# EAGLE schematic oresat-c3 (EAGLE 9.6.2), part 1 of 2
Assembly variants: LESS_STUFF

## Sheet 1 of 8: Connectors
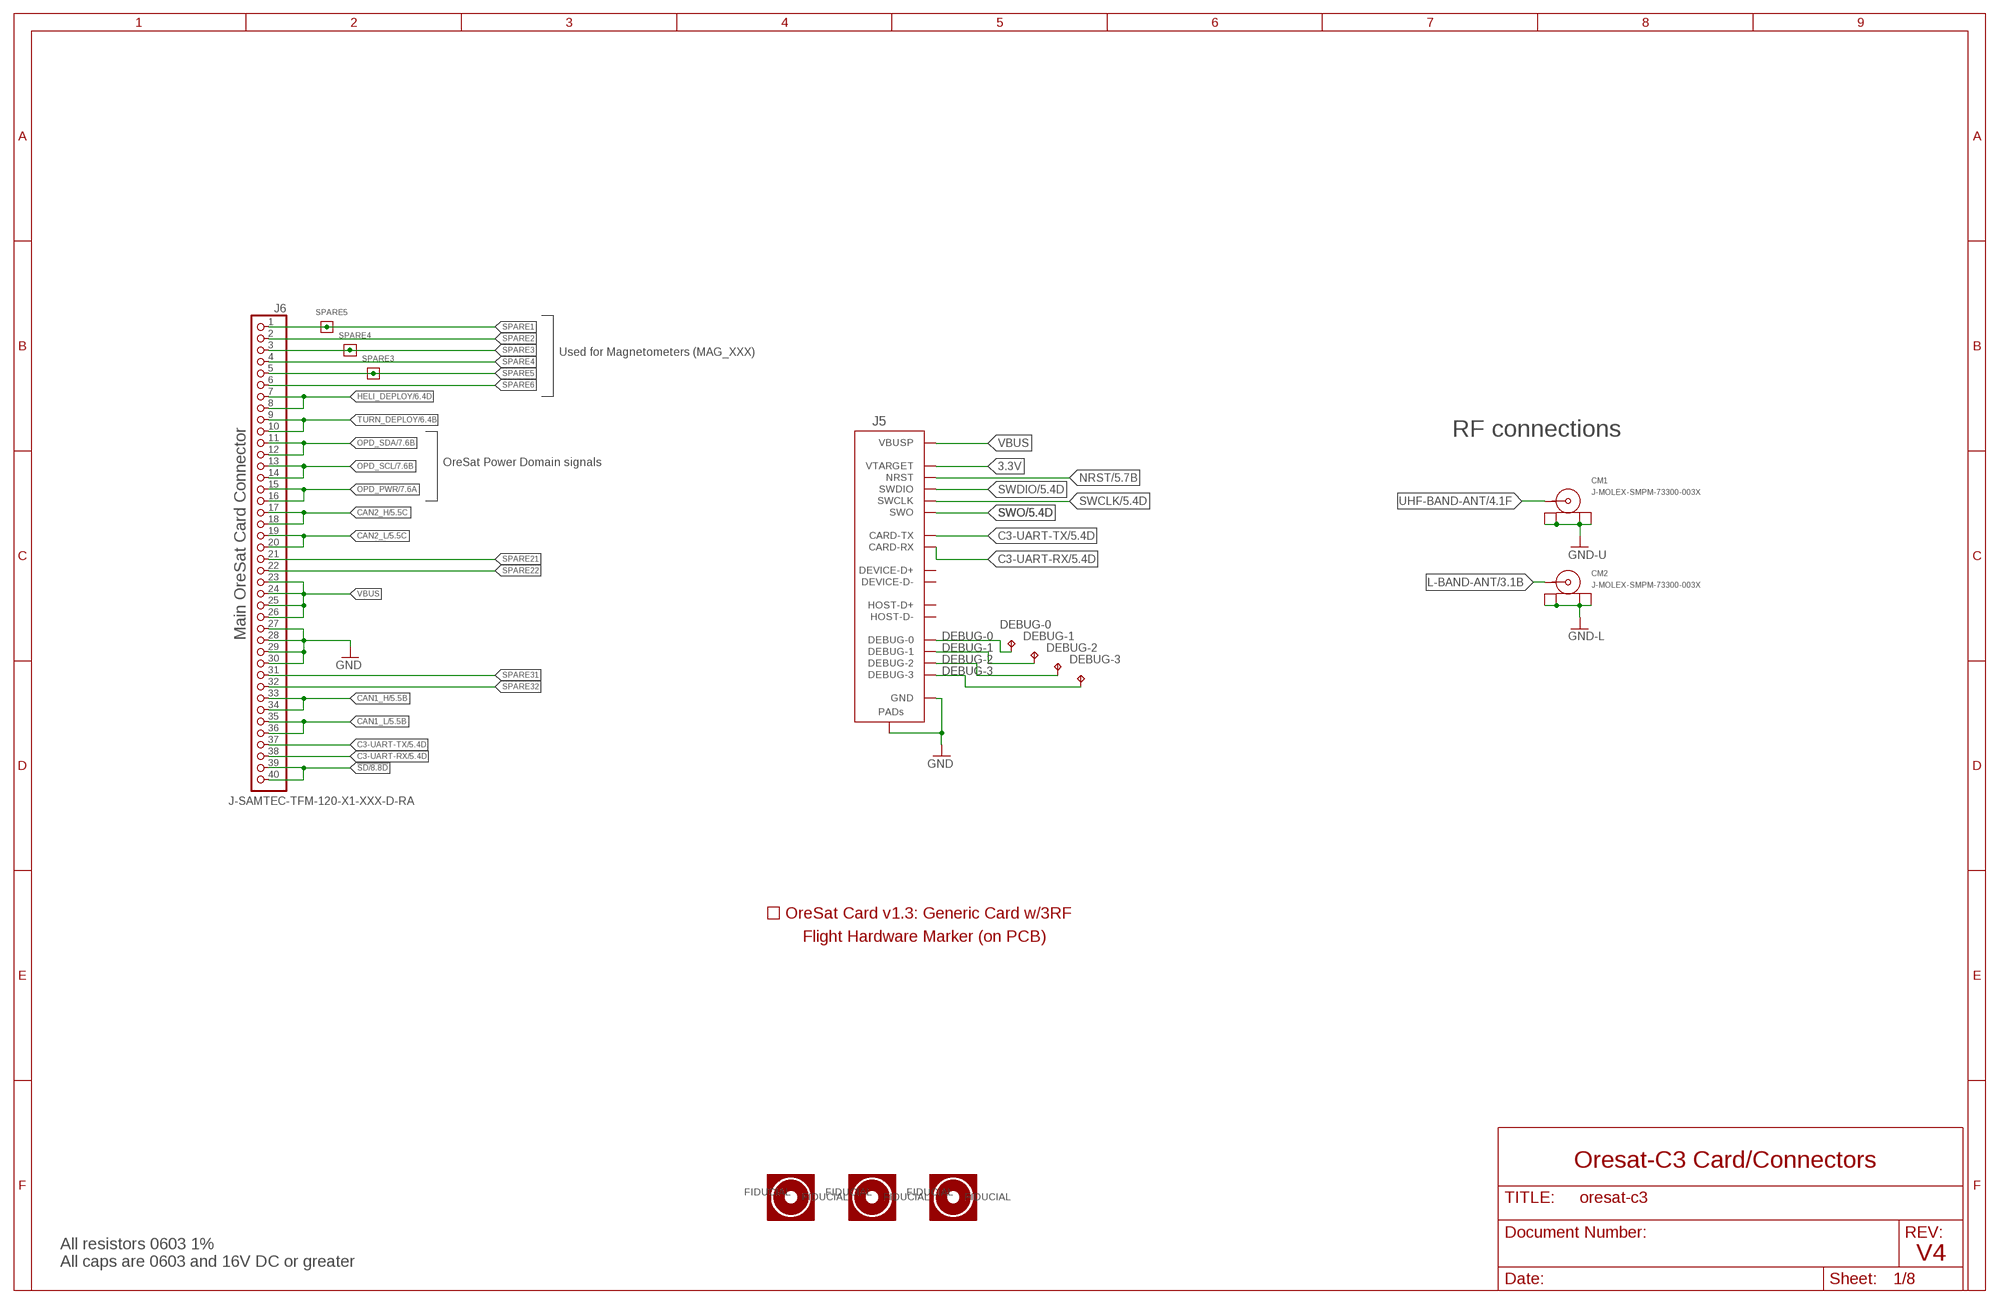
[diagram p0: schematic, sheet 1]

### Parts
CM1  J-MOLEX-SMPM-73300-003X  [J-MOLEX-SMPM-073300-003X]
CM2  J-MOLEX-SMPM-73300-003X  [J-MOLEX-SMPM-073300-003X]
DEBUG-0  TEST-POINT-SMALL  [TEST-POINT-SMALL]
DEBUG-1  TEST-POINT-SMALL  [TEST-POINT-SMALL]
DEBUG-2  TEST-POINT-SMALL  [TEST-POINT-SMALL]
DEBUG-3  TEST-POINT-SMALL  [TEST-POINT-SMALL]
FIDUCIAL1  FIDUCIAL-1.0X2.0  [FIDUCIAL-1.0X2.0]
FIDUCIAL2  FIDUCIAL-1.0X2.0  [FIDUCIAL-1.0X2.0]
FIDUCIAL3  FIDUCIAL-1.0X2.0  [FIDUCIAL-1.0X2.0]
J5  ORESAT-DEBUG-CONNECTOR-ALL  [TE_2-1734592-0]
J6  J-SAMTEC-TFM-120-X1-XXX-D-RA  [J-SAMTEC-TFM-120-X1-XXX-D-RA]
PCB1  ORESAT-CARD-V1.3-GENERIC-3RF  [ORESAT-CARD-V1.3-GENERIC-3RF]
SPARE3  TEST-POINT-LARGE-SQUARE  [1X01]
SPARE4  TEST-POINT-LARGE-SQUARE  [1X01]
SPARE5  TEST-POINT-LARGE-SQUARE  [1X01]
U$1  FLIGHMARKERNEW  [FLIGHTMARKER_NEW_BOARDS]

### Nets
3.3V: J5.11(VTARGET) ; also sheet 2,3,5,7
!SD: J6.39 J6.40 ; also sheet 8
C3-UART-RX: J5.12(CARD-RX) J6.38 ; also sheet 5
C3-UART-TX: J5.13(CARD-TX) J6.37 ; also sheet 5
CAN1_H: J6.33 J6.34 ; also sheet 5
CAN1_L: J6.35 J6.36 ; also sheet 5
CAN2_H: J6.17 J6.18 ; also sheet 5
CAN2_L: J6.19 J6.20 ; also sheet 5
DEBUG-0: DEBUG-0.TP J5.17(DEBUG-0)
DEBUG-1: DEBUG-1.TP J5.18(DEBUG-1)
DEBUG-2: DEBUG-2.TP J5.19(DEBUG-2)
DEBUG-3: DEBUG-3.TP J5.20(DEBUG-3)
GND: J5.3(GND) J5.6(GND) J5.9(GND) J5.PAD1(PAD) J5.PAD2(PAD) J6.27 J6.28 J6.29 J6.30 ; also sheet 2,3,4,5,6,7,8
GND-L: CM2.P$1(SHIELD3) CM2.P$2(SHIELD2) CM2.P$3(SHIELD1) CM2.P$4(SHIELD) ; also sheet 2,3
GND-U: CM1.P$1(SHIELD3) CM1.P$2(SHIELD2) CM1.P$3(SHIELD1) CM1.P$4(SHIELD) ; also sheet 2,4
HELI_DEPLOY: J6.7 J6.8 ; also sheet 6
L-BAND-ANT [RF]: CM2.RF(CENTER) ; also sheet 3
NRST: J5.10(NRST) ; also sheet 5
OPD_PWR: J6.15 J6.16 ; also sheet 7
OPD_SCL: J6.13 J6.14 ; also sheet 7
OPD_SDA: J6.11 J6.12 ; also sheet 7
SPARE1: J6.1 SPARE5.1
SPARE2: J6.2
SPARE3: J6.3 SPARE4.1
SPARE4: J6.4
SPARE5: J6.5 SPARE3.1
SPARE6: J6.6
SPARE21: J6.21
SPARE22: J6.22
SPARE31: J6.31
SPARE32: J6.32
SWCLK: J5.15(SWCLK) ; also sheet 5
SWDIO: J5.14(SWDIO) ; also sheet 5
SWO: J5.16(SWO) ; also sheet 5
TURN_DEPLOY: J6.9 J6.10 ; also sheet 6
UHF-BAND-ANT [RF]: CM1.RF(CENTER) ; also sheet 4
VBUS: J5.1(VBUSP) J5.2(VBUSP) J6.23 J6.24 J6.25 J6.26 ; also sheet 2,6,8
Unconnected: FIDUCIAL1.FIDUCIAL FIDUCIAL2.FIDUCIAL FIDUCIAL3.FIDUCIAL J5.4(DEVICE-D+) J5.5(DEVICE-D-) J5.7(HOST-D+) J5.8(HOST-D-)

### Notes on the sheet
- Used for Magnetometers (MAG_XXX)
- RF connections
- OreSat Power Domain signals
- Main OreSat Card Connector
- Oresat-C3 Card/Connectors
- V4
- All resistors 0603 1%
  All caps are 0603 and 16V DC or greater

## Sheet 2 of 8: Power
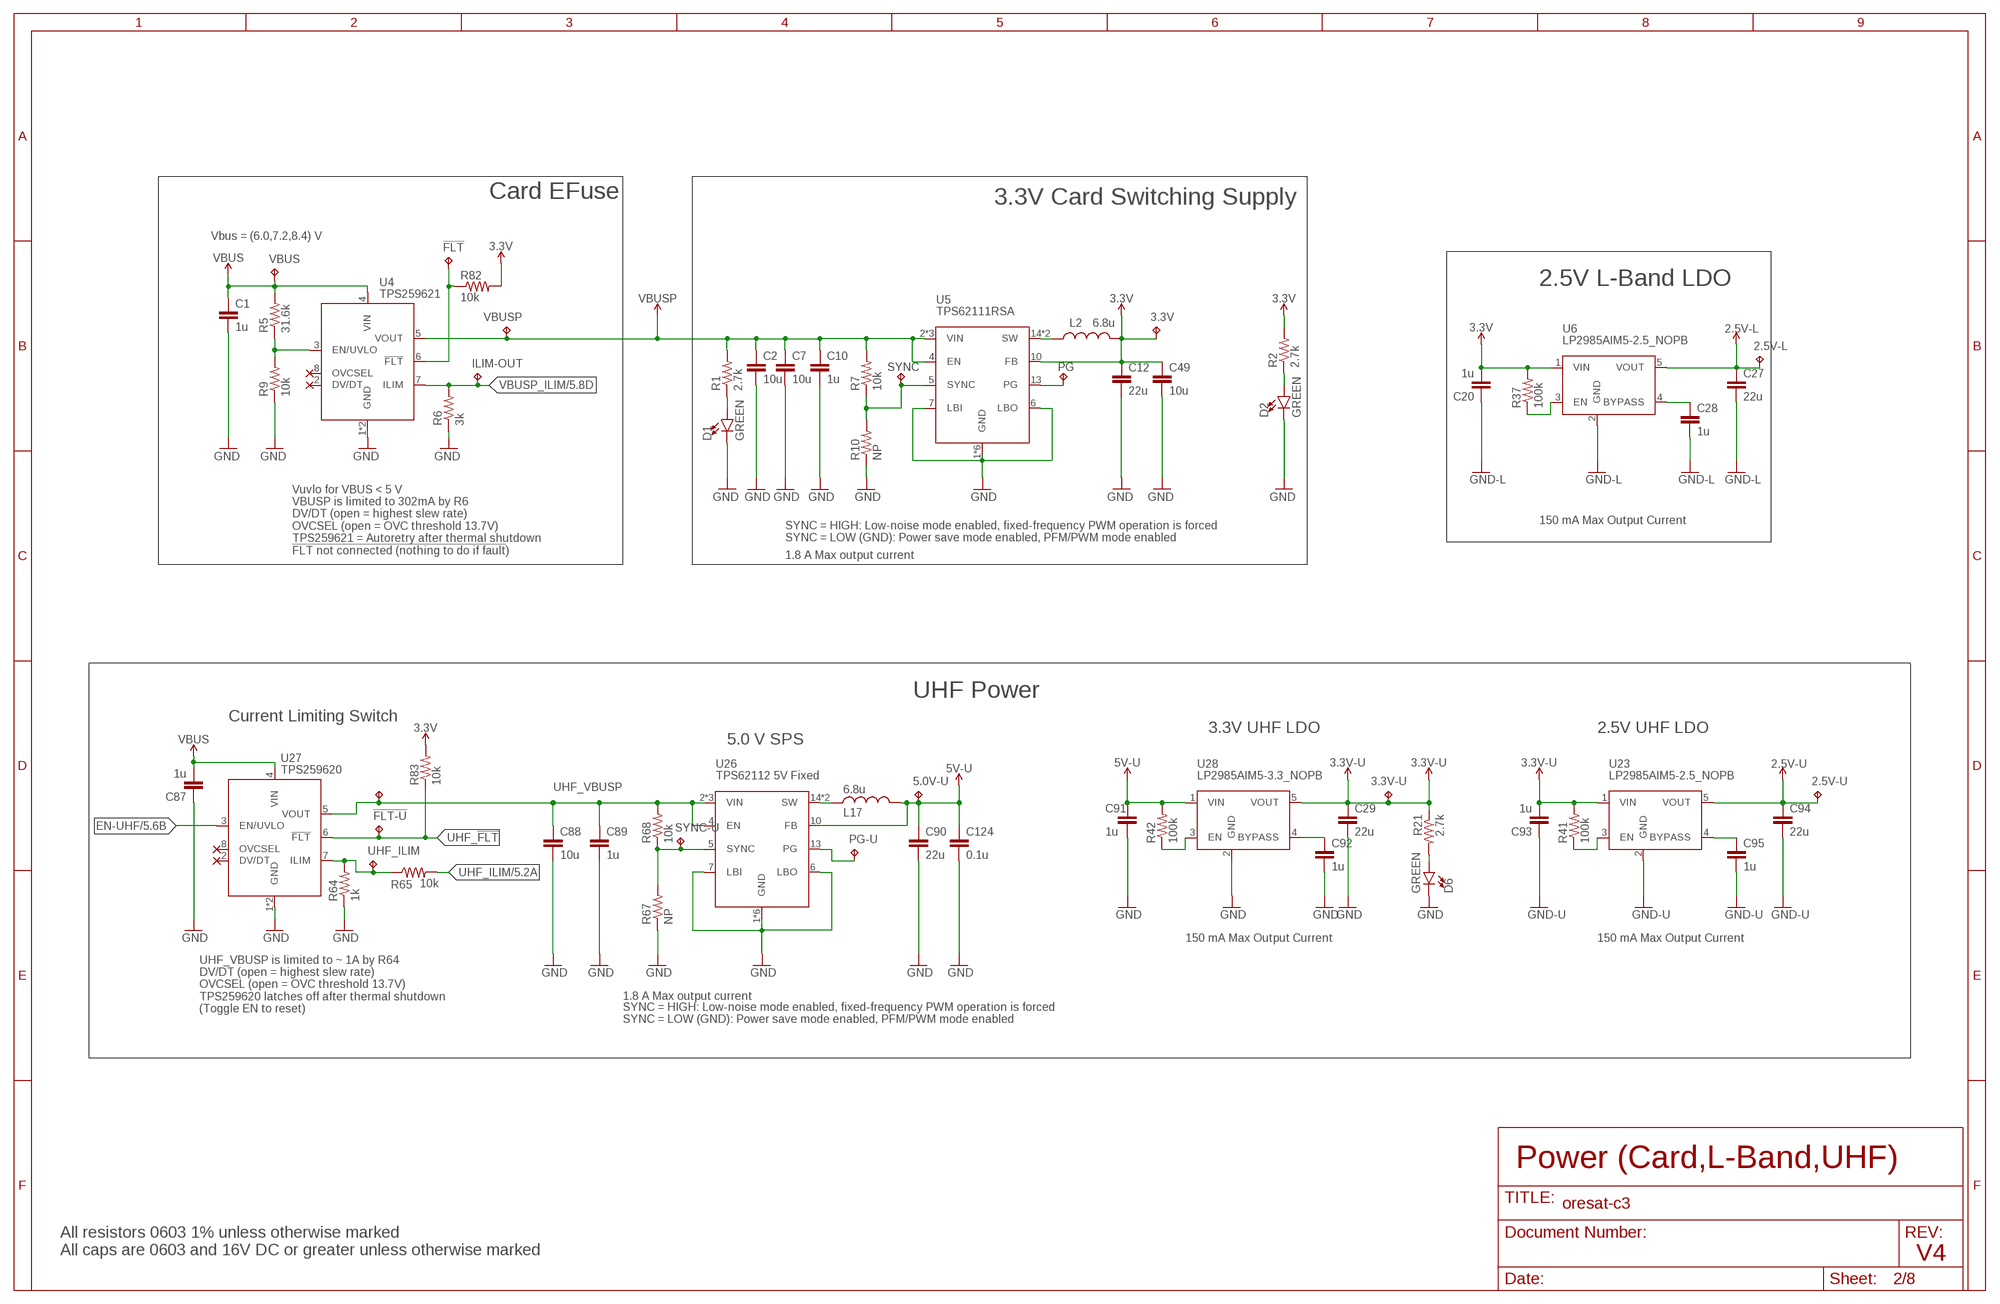
[diagram p1: schematic, sheet 2]

### Parts
2.5V-L  TEST-POINT-LARGE  [1X01]
2.5V-U  TEST-POINT-LARGE  [1X01]
3.3V  TEST-POINT-LARGE  [1X01]
3.3V-U  TEST-POINT-LARGE  [1X01]
5.0V-U  TEST-POINT-LARGE  [1X01]
!FLT  TEST-POINT-LARGE  [1X01]
!FLT-U  TEST-POINT-LARGE  [1X01]
C1  1u  C-EU0603-C-NOSILK  [.0603-C-NOSILK]
C2  10u  C-EU0603-C-NOSILK  [.0603-C-NOSILK]
C7  10u  C-EU0603-C-NOSILK  [.0603-C-NOSILK]
C10  1u  C-EU0603-C-NOSILK  [.0603-C-NOSILK]
C12  22u  C-EU0603-C-NOSILK  [.0603-C-NOSILK]
C20  1u  C-EU0603-C-NOSILK  [.0603-C-NOSILK]
C27  22u  C-EU0603-C-NOSILK  [.0603-C-NOSILK]
C28  1u  C-EU0603-C-NOSILK  [.0603-C-NOSILK]
C29  22u  C-EU0603-C-NOSILK  [.0603-C-NOSILK]
C49  10u  C-EU0603-C-NOSILK  [.0603-C-NOSILK]
C87  1u  C-EU0603-C-NOSILK  [.0603-C-NOSILK]
C88  10u  C-EU0603-C-NOSILK  [.0603-C-NOSILK]
C89  1u  C-EU0603-C-NOSILK  [.0603-C-NOSILK]
C90  22u  C-EU0603-C-NOSILK  [.0603-C-NOSILK]
C91  1u  C-EU0603-C-NOSILK  [.0603-C-NOSILK]
C92  1u  C-EU0603-C-NOSILK  [.0603-C-NOSILK]
C93  1u  C-EU0603-C-NOSILK  [.0603-C-NOSILK]
C94  22u  C-EU0603-C-NOSILK  [.0603-C-NOSILK]
C95  1u  C-EU0603-C-NOSILK  [.0603-C-NOSILK]
C124  0.1u  C-EU0603-C-NOSILK  [.0603-C-NOSILK]
D1  GREEN  LED-GREEN0603  [LED-0603]
D2  GREEN  LED-GREEN0603  [LED-0603]
D6  GREEN  LED-GREEN0603  [LED-0603]
ILIM-OUT  TEST-POINT-LARGE  [1X01]
L2  6.8u  L-ECS-MPI4040  [ECS-MPI4040]
L17  6.8u  L-ECS-MPI4040  [ECS-MPI4040]
PG  TEST-POINT-LARGE  [1X01]
PG-U  TEST-POINT-LARGE  [1X01]
R1  2.7k  R-US_0603-C-NOSILK  [.0603-C-NOSILK]
R2  2.7k  R-US_0603-C-NOSILK  [.0603-C-NOSILK]
R5  31.6k  R-US_0603-C-NOSILK  [.0603-C-NOSILK]
R6  3k  R-US_0603-C-NOSILK  [.0603-C-NOSILK]
R7  10k  R-US_0603-C-NOSILK  [.0603-C-NOSILK]
R9  10k  R-US_0603-C-NOSILK  [.0603-C-NOSILK]
R10  NP  R-US_0603-C-NOSILK  [.0603-C-NOSILK]  (not fitted in variant LESS_STUFF)
R21  2.7k  R-US_0603-C-NOSILK  [.0603-C-NOSILK]
R37  100k  R-US_0603-C-NOSILK  [.0603-C-NOSILK]
R41  100k  R-US_0603-C-NOSILK  [.0603-C-NOSILK]
R42  100k  R-US_0603-C-NOSILK  [.0603-C-NOSILK]
R64  1k  R-US_0603-C-NOSILK  [.0603-C-NOSILK]
R65  10k  R-US_0603-C-NOSILK  [.0603-C-NOSILK]
R67  NP  R-US_0603-C-NOSILK  [.0603-C-NOSILK]
R68  10k  R-US_0603-C-NOSILK  [.0603-C-NOSILK]
R82  10k  R-US_0603-C-NOSILK  [.0603-C-NOSILK]
R83  10k  R-US_0603-C-NOSILK  [.0603-C-NOSILK]
SYNC  TEST-POINT-LARGE  [1X01]
SYNC-U  TEST-POINT-LARGE  [1X01]
TP13  NO-CONNECTNO-CONNECT-DEVICE  [NO-CONNECT-FOOTPRINT]
TP19  NO-CONNECTNO-CONNECT-DEVICE  [NO-CONNECT-FOOTPRINT]
TP21  NO-CONNECTNO-CONNECT-DEVICE  [NO-CONNECT-FOOTPRINT]
TP22  NO-CONNECTNO-CONNECT-DEVICE  [NO-CONNECT-FOOTPRINT]
U4  TPS259621  TPS2596XX  [SO-POWERPAD-8]
U5  TPS62111RSA  TPS6211X  [S-PVQFN-16]
U6  LP2985AIM5-2.5_NOPB  [SOT-23]
U23  LP2985AIM5-2.5_NOPB  [SOT-23]
U26  TPS62112  TPS6211X  [S-PVQFN-16]
U27  TPS259620  TPS2596XX  [SO-POWERPAD-8]
U28  LP2985AIM5-3.3_NOPB  [SOT-23]
UHF_ILIM  TEST-POINT-LARGE  [1X01]
VBUS  TEST-POINT-LARGE  [1X01]
VBUSP  TEST-POINT-LARGE  [1X01]
VBUSP-OUT-U  TEST-POINT-LARGE  [1X01]

### Nets
2.5V-L: 2.5V-L.1(TP) C27.1 U6.5(VOUT) ; also sheet 3
2.5V-U: 2.5V-U.1(TP) C94.1 U23.5(VOUT) ; also sheet 4
3.3V: 3.3V.1(TP) C12.1 C20.2 C49.1 L2.2 R2.2 R37.2 R82.2 R83.2 U5.10(FB) U6.1(VIN) ; also sheet 1,3,5,7
3.3V-U: 3.3V-U.1(TP) C29.1 C93.2 R21.1 R41.2 U23.1(VIN) U28.5(VOUT) ; also sheet 4
5V-U: 5.0V-U.1(TP) C90.1 C91.1 C124.1 L17.1 R42.2 U26.10(FB) U28.1(VIN) ; also sheet 4
!CB_FLT: !FLT.1(TP) R82.1 U4.6(!FLT)
EN-UHF: U27.3(EN/UVLO) ; also sheet 5
EN/UVLO: R5.1 R9.2 U4.3(EN/UVLO)
GND: C1.2 C2.2 C7.2 C10.2 C12.2 C29.2 C49.2 C87.1 C88.2 C89.2 C90.2 C91.2 C92.2 C124.2 D1.C D2.C D6.C R6.1 R9.1 R10.1 R64.1 R67.1 U4.1(GND) U4.THERMAL(GND) U5.1(GND) U5.6(LBO) U5.7(LBI) U5.9(GND) U5.11(GND) U5.12(GND) U5.16(GND) U5.PAD(GND) U26.1(GND) U26.6(LBO) U26.7(LBI) U26.9(GND) U26.11(GND) U26.12(GND) U26.16(GND) U26.PAD(GND) U27.1(GND) U27.THERMAL(GND) U28.2(GND) ; also sheet 1,3,4,5,6,7,8
GND-L: C20.1 C27.2 C28.2 U6.2(GND) ; also sheet 1,3
GND-U: C93.1 C94.2 C95.2 U23.2(GND) ; also sheet 1,4
LEDPWR3: D6.A R21.2
N$8: C95.1 U23.4(BYPASS)
N$25: C28.1 U6.4(BYPASS)
N$30: R37.1 U6.3(EN)
N$34: R41.1 U23.3(EN)
N$42: L17.2 U26.14(SW) U26.15(SW)
N$43: PG-U.1(TP) U26.13(PG)
N$44: R67.2 R68.1 SYNC-U.1(TP) U26.5(SYNC)
N$45: R42.1 U28.3(EN)
N$49: C92.1 U28.4(BYPASS)
N$270: D1.A R1.1
N$271: D2.A R2.1
SW: L2.1 U5.14(SW) U5.15(SW)
TPS62111-PG: PG.1(TP) U5.13(PG)
TPS62111-SYNC: R7.1 R10.2 SYNC.1(TP) U5.5(SYNC)
UHF_!FLT: !FLT-U.1(TP) R83.1 U27.6(!FLT) ; also sheet 5
UHF_ILIM: R65.2 ; also sheet 5
UHF_ILIM_RAW: R64.2 R65.1 U27.7(ILIM) UHF_ILIM.1(TP)
UHF_VBUSP: C88.1 C89.1 R68.2 U26.2(VIN) U26.3(VIN) U26.4(EN) U26.8(VIN) U27.5(VOUT) VBUSP-OUT-U.1(TP)
VBUS: C1.1 C87.2 R5.2 U4.4(VIN) U27.4(VIN) VBUS.1(TP) ; also sheet 1,6,8
VBUSP: C2.1 C7.1 C10.1 R1.2 R7.2 U4.5(VOUT) U5.2(VIN) U5.3(VIN) U5.4(EN) U5.8(VIN) VBUSP.1(TP)
VBUSP_ILIM: ILIM-OUT.1(TP) R6.2 U4.7(ILIM) ; also sheet 5
Unconnected: U4.2(DV/DT) U4.8(OVCSEL) U27.2(DV/DT) U27.8(OVCSEL)

### Notes on the sheet
- Card EFuse | 3.3V Card Switching Supply
- Vbus = (6.0,7.2,8.4) V
- 2.5V L-Band LDO
- 150 mA Max Output Current
- SYNC = HIGH: Low-noise mode enabled, fixed-frequency PWM operation is forced
  SYNC = LOW (GND): Power save mode enabled, PFM/PWM mode enabled
- Vuvlo for VBUS < 5 V
  VBUSP is limited to 302mA by R6
  DV/DT (open = highest slew rate)
  OVCSEL (open = OVC threshold 13.7V)
  TPS259621 = Autoretry after thermal shutdown
  !FLT not connected (nothing to do if fault!)
- 1.8 A Max output current
- UHF Power
- Current Limiting Switch
- 3.3V UHF LDO | 2.5V UHF LDO
- 5.0 V SPS
- 5V Fixed
- 150 mA Max Output Current | 150 mA Max Output Current
- 1.8 A Max output current
- UHF_VBUSP is limited to ~ 1A by R64
  DV/DT (open = highest slew rate)
  OVCSEL (open = OVC threshold 13.7V)
  TPS259620 latches off after thermal shutdown
  (Toggle EN to reset)
- SYNC = HIGH: Low-noise mode enabled, fixed-frequency PWM operation is forced
  SYNC = LOW (GND): Power save mode enabled, PFM/PWM mode enabled
- Power (Card,L-Band,UHF)
- All resistors 0603 1% unless otherwise marked
  All caps are 0603 and 16V DC or greater unless otherwise marked
- V4

## Sheet 3 of 8: L Band
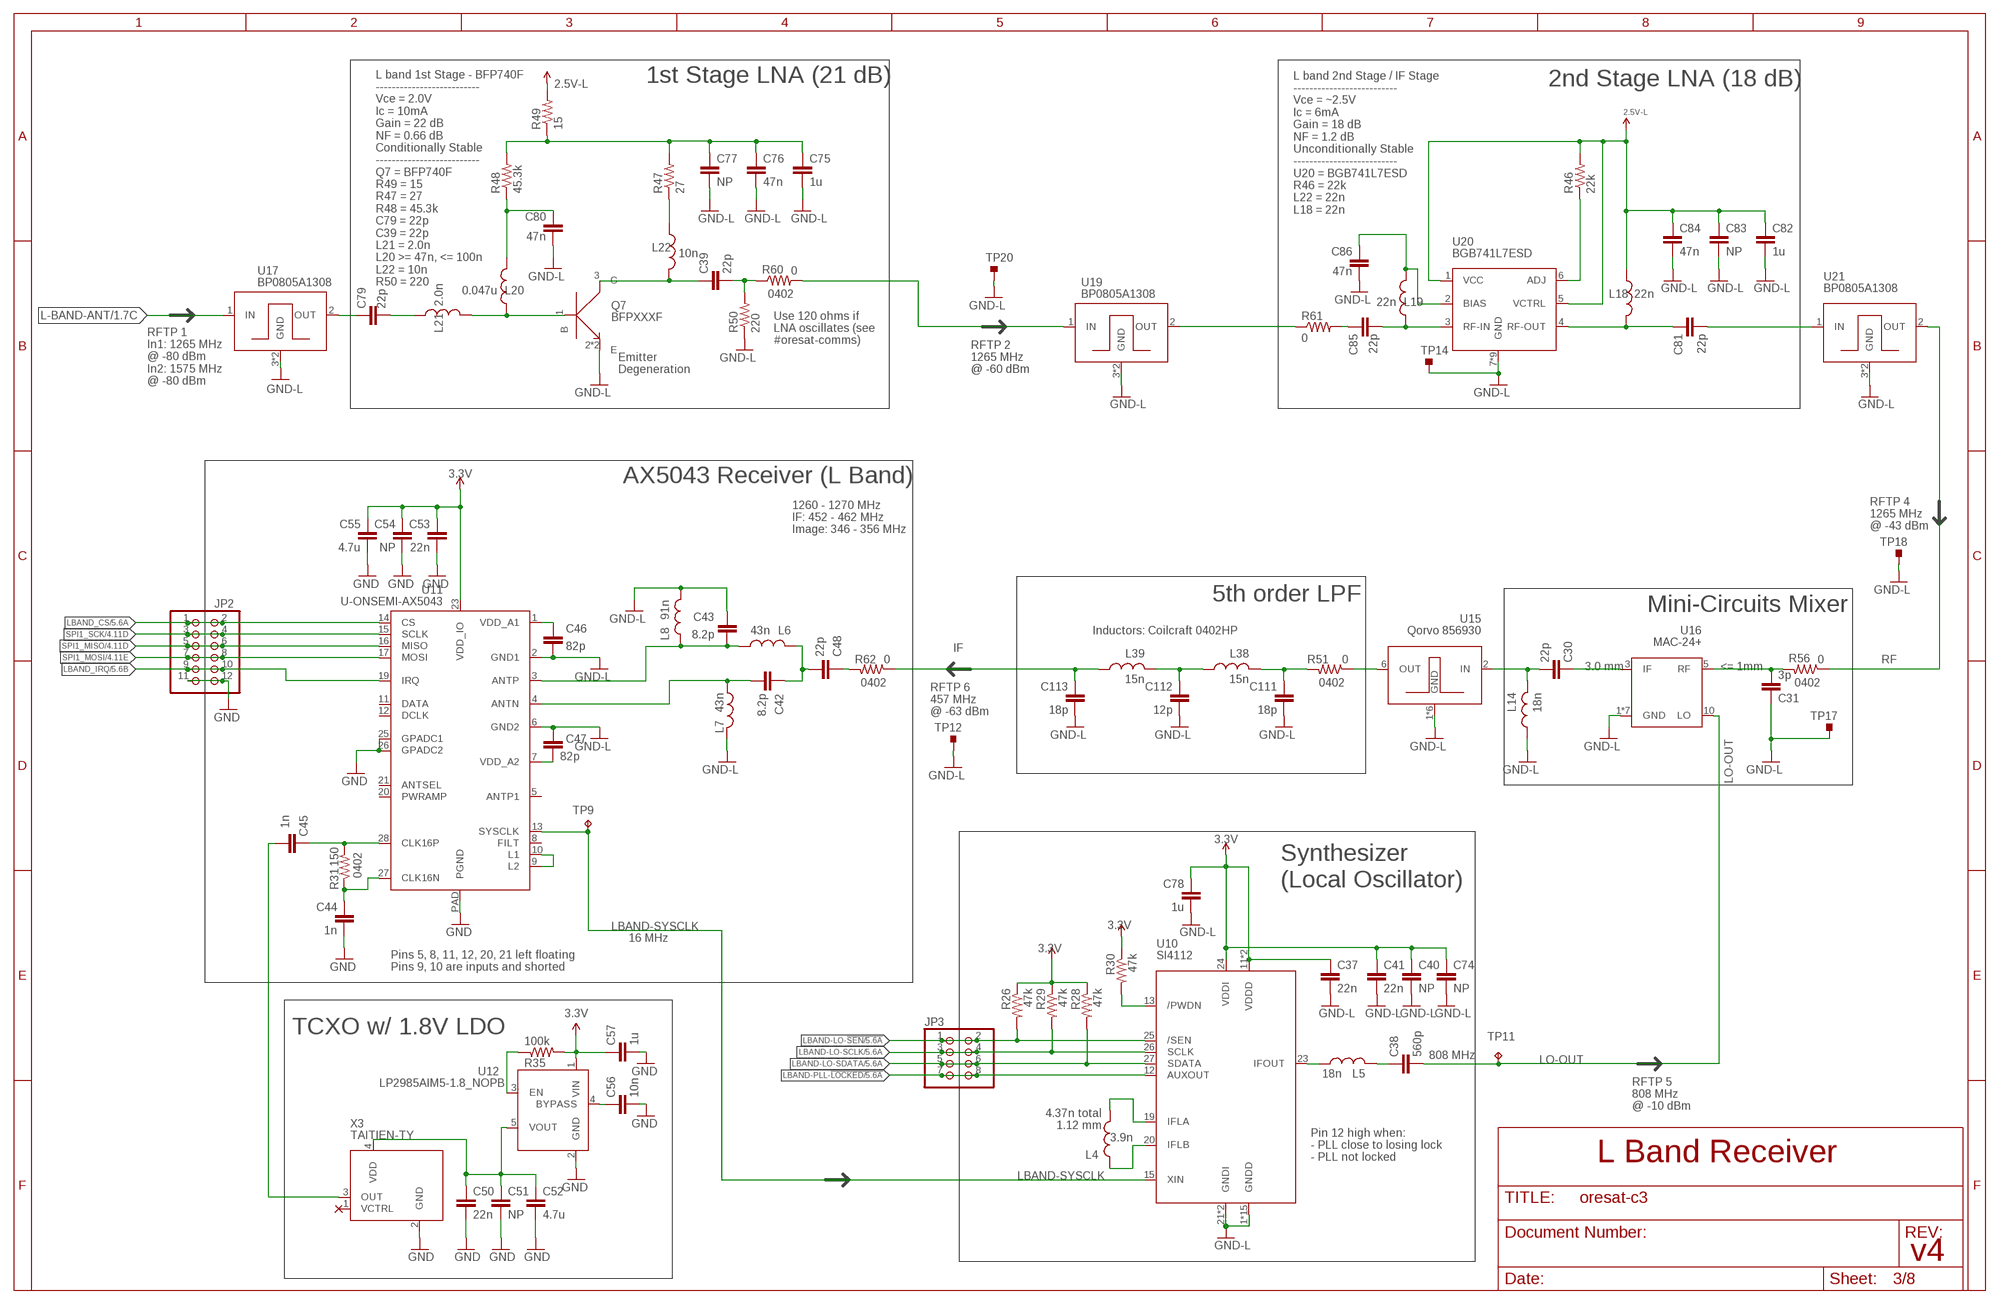
[diagram p2: schematic, sheet 3]

### Parts
C30  22p  C-EU0402-C-NOSILK  [.0402-C-NOSILK]
C31  3p  C-EU0402-C-NOSILK  [.0402-C-NOSILK]
C37  22n  C-EU0603-C-NOSILK  [.0603-C-NOSILK]
C38  560p  C-EU0402-C-NOSILK  [.0402-C-NOSILK]
C39  22p  C-EU0402-C-NOSILK  [.0402-C-NOSILK]
C40  NP  C-EU0603-C-NOSILK  [.0603-C-NOSILK]
C41  22n  C-EU0603-C-NOSILK  [.0603-C-NOSILK]
C42  8.2p  C-EU0402-C-NOSILK  [.0402-C-NOSILK]
C43  8.2p  C-EU0402-C-NOSILK  [.0402-C-NOSILK]
C44  1n  C-EU0402-C-NOSILK  [.0402-C-NOSILK]
C45  1n  C-EU0402-C-NOSILK  [.0402-C-NOSILK]
C46  82p  C-EU0402-C-NOSILK  [.0402-C-NOSILK]
C47  82p  C-EU0402-C-NOSILK  [.0402-C-NOSILK]
C48  22p  C-EU0402-C-NOSILK  [.0402-C-NOSILK]
C50  22n  C-EU0603-C-NOSILK  [.0603-C-NOSILK]
C51  NP  C-EU0603-C-NOSILK  [.0603-C-NOSILK]
C52  4.7u  C-EU0603-C-NOSILK  [.0603-C-NOSILK]
C53  22n  C-EU0603-C-NOSILK  [.0603-C-NOSILK]
C54  NP  C-EU0603-C-NOSILK  [.0603-C-NOSILK]
C55  4.7u  C-EU0603-C-NOSILK  [.0603-C-NOSILK]
C56  10n  C-EU0603-C-NOSILK  [.0603-C-NOSILK]
C57  1u  C-EU0603-C-NOSILK  [.0603-C-NOSILK]
C74  NP  C-EU0603-C-NOSILK  [.0603-C-NOSILK]
C75  1u  C-EU0603-C-NOSILK  [.0603-C-NOSILK]
C76  47n  C-EU0603-C-NOSILK  [.0603-C-NOSILK]
C77  NP  C-EU0603-C-NOSILK  [.0603-C-NOSILK]
C78  1u  C-EU0603-C-NOSILK  [.0603-C-NOSILK]
C79  22p  C-EU0402-C-NOSILK  [.0402-C-NOSILK]
C80  47n  C-EU0603-C-NOSILK  [.0603-C-NOSILK]
C81  22p  C-EU0402-C-NOSILK  [.0402-C-NOSILK]
C82  1u  C-EU0603-C-NOSILK  [.0603-C-NOSILK]
C83  NP  C-EU0603-C-NOSILK  [.0603-C-NOSILK]
C84  47n  C-EU0402-C-NOSILK  [.0402-C-NOSILK]
C85  22p  C-EU0402-C-NOSILK  [.0402-C-NOSILK]
C86  47n  C-EU0402-C-NOSILK  [.0402-C-NOSILK]
C111  18p  C-EU0402-C-NOSILK  [.0402-C-NOSILK]
C112  12p  C-EU0402-C-NOSILK  [.0402-C-NOSILK]
C113  18p  C-EU0402-C-NOSILK  [.0402-C-NOSILK]
JP2  PINHD-2X6  [2X06]
JP3  PINHD-2X4  [2X04]
L4  3.9n  L-US0402-C-NOSILK  [.0402-C-NOSILK]
L5  18n  L-US0402-C-NOSILK  [.0402-C-NOSILK]
L6  43n  L-US0402-C-NOSILK  [.0402-C-NOSILK]
L7  43n  L-US0402-C-NOSILK  [.0402-C-NOSILK]
L8  91n  L-US0603-C-NOSILK  [.0603-C-NOSILK]
L14  18n  L-US0402-C-NOSILK  [.0402-C-NOSILK]
L18  22n  L-US0603-C-NOSILK  [.0603-C-NOSILK]
L19  22n  L-US0603-C-NOSILK  [.0603-C-NOSILK]
L20  0.047u  L-US0603-C-NOSILK  [.0603-C-NOSILK]
L21  2.0n  L-US0402-C-NOSILK  [.0402-C-NOSILK]
L22  10n  L-US0603-C-NOSILK  [.0603-C-NOSILK]
L38  15n  L-US0402-C-NOSILK  [.0402-C-NOSILK]
L39  15n  L-US0402-C-NOSILK  [.0402-C-NOSILK]
Q7  BFPXXXF  [TSFP4]
R26  47k  R-US_0603-C-NOSILK  [.0603-C-NOSILK]
R28  47k  R-US_0603-C-NOSILK  [.0603-C-NOSILK]
R29  47k  R-US_0603-C-NOSILK  [.0603-C-NOSILK]
R30  47k  R-US_0603-C-NOSILK  [.0603-C-NOSILK]
R31  150  R-US_0402-C-NOSILK  [.0402-C-NOSILK]
R35  100k  R-US_0603-C-NOSILK  [.0603-C-NOSILK]
R46  22k  R-US_0603-C-NOSILK  [.0603-C-NOSILK]
R47  27  R-US_0603-C-NOSILK  [.0603-C-NOSILK]
R48  45.3k  R-US_0603-C-NOSILK  [.0603-C-NOSILK]
R49  15  R-US_0603-C-NOSILK  [.0603-C-NOSILK]
R50  220  R-US_0603-C-NOSILK  [.0603-C-NOSILK]
R51  0  R-US_0402-C-NOSILK  [.0402-C-NOSILK]
R56  0  R-US_0402-C-NOSILK  [.0402-C-NOSILK]
R60  0  R-US_0402-C-NOSILK  [.0402-C-NOSILK]
R61  0  R-US_0402-C-NOSILK  [.0402-C-NOSILK]
R62  0  R-US_0402-C-NOSILK  [.0402-C-NOSILK]
TP8  NO-CONNECTNO-CONNECT-DEVICE  [NO-CONNECT-FOOTPRINT]
TP9  TEST-PAD-SMD-CIRCLE  [TESTPOINT_SMD-CIRCLE-1MM]
TP11  TEST-PAD-SMD-CIRCLE  [TESTPOINT_SMD-CIRCLE-1MM]
TP12  TEST-POINT_SMD-SMD-10SN  [TESTPOINT_SMD-10SN]
TP14  TEST-POINT_SMD-SMD-10SN  [TESTPOINT_SMD-10SN]
TP17  TEST-POINT_SMD-SMD-10SN  [TESTPOINT_SMD-10SN]
TP18  TEST-POINT_SMD-SMD-10SN  [TESTPOINT_SMD-10SN]
TP20  TEST-POINT_SMD-SMD-10SN  [TESTPOINT_SMD-10SN]
U10  SI4112  [QFN28-5X5-WITH-CENTER-PAD]
U11  U-ONSEMI-AX5043  [QFN28-5X5-WITH-CENTER-PAD]
U12  LP2985AIM5-1.8_NOPB  [SOT-23]
U15  Qorvo 856930  856930  [3.8X3.8]
U16  MAC-24+  [MAC-24+]
U17  BP0805A1308  [BP0805]
U19  BP0805A1308  [BP0805]
U20  BGB741L7ESD  BGB7XXL7ESD  [BGB7XXL7ESD]
U21  BP0805A1308  [BP0805]
X3  TAITIEN-TY  [2.5X2.0]

### Nets
1V8: C50.1 C51.1 C52.1 U12.5(VOUT) X3.4(VDD)
2.5V-L: C82.1 C83.1 C84.1 L18.1 R46.2 R49.2 U20.1(VCC) U20.5(VCTRL) ; also sheet 2
3.3V: C37.1 C40.1 C41.1 C53.1 C54.1 C55.1 C57.1 C74.1 C78.1 R26.1 R28.1 R29.1 R30.1 R35.2 U10.11(VDDD) U10.17(VDDD) U10.24(VDDI) U11.23(VDD_IO) U12.1(VIN) ; also sheet 1,2,5,7
ANTN1 [RF]: C42.2 L7.2 U11.4(ANTN)
ANTP2 [RF]: C43.2 L6.2 L8.1 U11.3(ANTP)
B1 [RF]: L20.1 L21.2 Q7.1(B)
C1 [RF]: C39.1 L22.2 Q7.3(C)
CAPS1: C75.1 C76.1 C77.1 R47.2 R48.2 R49.1
CLKN1: C44.1 R31.1 U11.27(CLK16N)
CLKP1: C45.1 R31.2 U11.28(CLK16P)
GND: C44.2 C50.2 C51.2 C52.2 C53.2 C54.2 C55.2 C56.2 C57.2 JP2.11 JP2.12 U11.25(GPADC1) U11.26(GPADC2) U11.PAD(PGND) U12.2(GND) X3.2(GND) ; also sheet 1,2,4,5,6,7,8
GND-L: C31.1 C37.2 C40.2 C41.2 C43.1 C46.2 C47.1 C74.2 C75.2 C76.2 C77.2 C78.2 C80.2 C82.2 C83.2 C84.2 C86.2 C111.2 C112.2 C113.2 L7.1 L8.2 L14.2 Q7.2(E) Q7.4(E) R50.1 TP12.TP TP14.TP TP17.TP TP18.TP TP20.TP U10.1(GNDD) U10.2(GNDD) U10.3(GNDD) U10.4(GNDD) U10.5(GNDD) U10.6(GNDD) U10.7(GNDD) U10.8(GNDD) U10.9(GNDD) U10.10(GNDD) U10.14(GNDD) U10.16(GNDD) U10.18(GNDD) U10.21(GNDI) U10.22(GNDI) U10.28(GNDD) U10.PAD(GNDD) U11.2(GND1) U11.6(GND2) U15.1(GND) U15.3(GND) U15.4(GND) U15.5(GND) U15.7(GND) U15.8(GND) U16.1(GND) U16.2(GND) U16.4(GND) U16.6(GND) U16.7(GND) U16.8(GND) U16.9(GND) U17.3(GND) U17.4(GND) U19.3(GND) U19.4(GND) U20.7(GND) U20.8(GND) U20.9(GND) U20.10(GND) U20.11(GND) U20.12(GND) U20.13(GND) U20.14(GND) U20.15(GND) U21.3(GND) U21.4(GND) ; also sheet 1,2
IF-SAW-OUT [RF]: C111.1 L38.1 R51.2
L-BAND-ANT [RF]: U17.1(IN) ; also sheet 1
L-BAND-RX [RF]: C113.1 L39.2 R62.1
L-BFP-LNA-RF_IN [RF]: C79.1 U17.2(OUT)
L-BFP-LNA-RF_OUT [RF]: R60.2 U19.1(IN)
L-BGB-LNA-RF_IN [RF]: R61.1 U19.2(OUT)
L-BGB-LNA-RF_OUT [RF]: C81.2 U21.1(IN)
LBAND-LO-!SEN: JP3.1 JP3.2 R26.2 U10.25(/SEN) ; also sheet 5
LBAND-LO-SCLK: JP3.3 JP3.4 R29.2 U10.26(SCLK) ; also sheet 5
LBAND-LO-SDATA: JP3.5 JP3.6 R28.2 U10.27(SDATA) ; also sheet 5
LBAND-PLL-!LOCKED: JP3.7 JP3.8 U10.12(AUXOUT) ; also sheet 5
LBAND-SYSCLK: TP9.TP U10.15(XIN) U11.13(SYSCLK)
LBAND_CS: JP2.1 JP2.2 U11.14(CS) ; also sheet 5
LBAND_IRQ: JP2.9 JP2.10 U11.19(IRQ) ; also sheet 5
LO-OUT [RF]: C38.2 TP11.TP U16.10(LO)
MIX-IF-OUT [RF]: C30.2 L14.1 U15.2(IN)
N$6: R30.2 U10.13(/PWDN)
N$7: C45.2 X3.3(OUT)
N$9: U11.9(L2) U11.10(L1)
N$10: C46.1 U11.1(VDD_A1)
N$11: C47.2 U11.7(VDD_A2)
N$12: C56.1 U12.4(BYPASS)
N$13 [RF]: C42.1 C48.2 L6.1
N$18 [RF]: C31.2 R56.2 U16.5(RF)
N$24 [RF]: C30.1 U16.3(IF)
N$26: R35.1 U12.3(EN)
N$27: C80.1 L20.2 R48.1
N$28: L22.1 R47.1
N$29 [RF]: C79.2 L21.1
N$31: L4.2 U10.19(IFLA)
N$32: L4.1 U10.20(IFLB)
N$33 [RF]: L5.1 U10.23(IFOUT)
N$35 [RF]: C38.1 L5.2
N$37 [RF]: C81.1 L18.2 U20.4(RF-OUT)
N$38: R46.1 U20.6(ADJ)
N$39 [RF]: C85.2 L19.1 U20.3(RF-IN)
N$40: C86.1 L19.2 U20.2(BIAS)
N$57 [RF]: C48.1 R62.2
N$59 [RF]: C85.1 R61.2
N$60 [RF]: C112.1 L38.2 L39.1
N$61 [RF]: C39.2 R50.2 R60.1
N$62 [RF]: R51.1 U15.6(OUT)
N$63 [RF]: R56.1 U21.2(OUT)
SPI1_MISO: JP2.5 JP2.6 U11.16(MISO) ; also sheet 4,5
SPI1_MOSI: JP2.7 JP2.8 U11.17(MOSI) ; also sheet 4,5
SPI1_SCK: JP2.3 JP2.4 U11.15(SCLK) ; also sheet 4,5
Unconnected: U11.5(ANTP1) U11.8(FILT) U11.11(DATA) U11.12(DCLK) U11.20(PWRAMP) U11.21(ANTSEL) X3.1(VCTRL)

### Notes on the sheet
- L band 1st Stage - BFP740F
  --------------------------
  Vce = 2.0V
  Ic = 10mA
  Gain = 22 dB
  NF = 0.66 dB
  Conditionally Stable
  --------------------------
  Q7 = BFP740F
  R49 = 15
  R47 = 27
  R48 = 45.3k
  C79 = 22p
  C39 = 22p
  L21 = 2.0n
  L20 >= 47n, <= 100n
  L22 = 10n
  R50 = 220
- L band 2nd Stage / IF Stage
  --------------------------
  Vce = ~2.5V
  Ic = 6mA
  Gain = 18 dB
  NF = 1.2 dB
  Unconditionally Stable
  --------------------------
  U20 = BGB741L7ESD
  R46 = 22k
  L22 = 22n
  L18 = 22n
- 1st Stage LNA (21 dB) | 2nd Stage LNA (18 dB)
- 0402
- Use 120 ohms if
  LNA oscillates (see
  #oresat-comms)
- Emitter
  Degeneration
- RFTP 2
  1265 MHz
  @ -60 dBm
- RFTP 1
  In1: 1265 MHz
  @ -80 dBm
  In2: 1575 MHz
  @ -80 dBm
- AX5043 Receiver (L Band)
- RFTP 4
  1265 MHz
  @ -43 dBm
- 1260 - 1270 MHz 
  IF: 452 - 462 MHz
  Image: 346 - 356 MHz
- 5th order LPF
- Mini-Circuits Mixer
- Inductors: Coilcraft 0402HP
- IF
- RF
- 3.0 mm | <= 1mm
- 0402 | 0402 | 0402
- RFTP 6
  457 MHz
  @ -63 dBm
- 0402
- Synthesizer 
  (Local Oscillator)
- 16 MHz
- Pins 5, 8, 11, 12, 20, 21 left floating
  Pins 9, 10 are inputs and shorted
- TCXO w/ 1.8V LDO
- 808 MHz
- 4.37n total
  1.12 mm
- RFTP 5
  808 MHz
  @ -10 dBm
- Pin 12 high when:
  - PLL close to losing lock
  - PLL not locked
- L Band Receiver
- v4

## Sheet 4 of 8: UHF Band
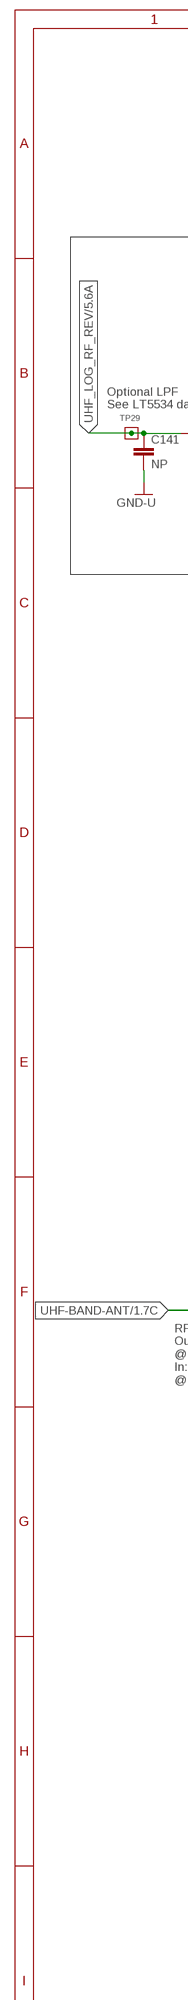
[diagram p3: schematic, sheet 4, part 1 of 2]
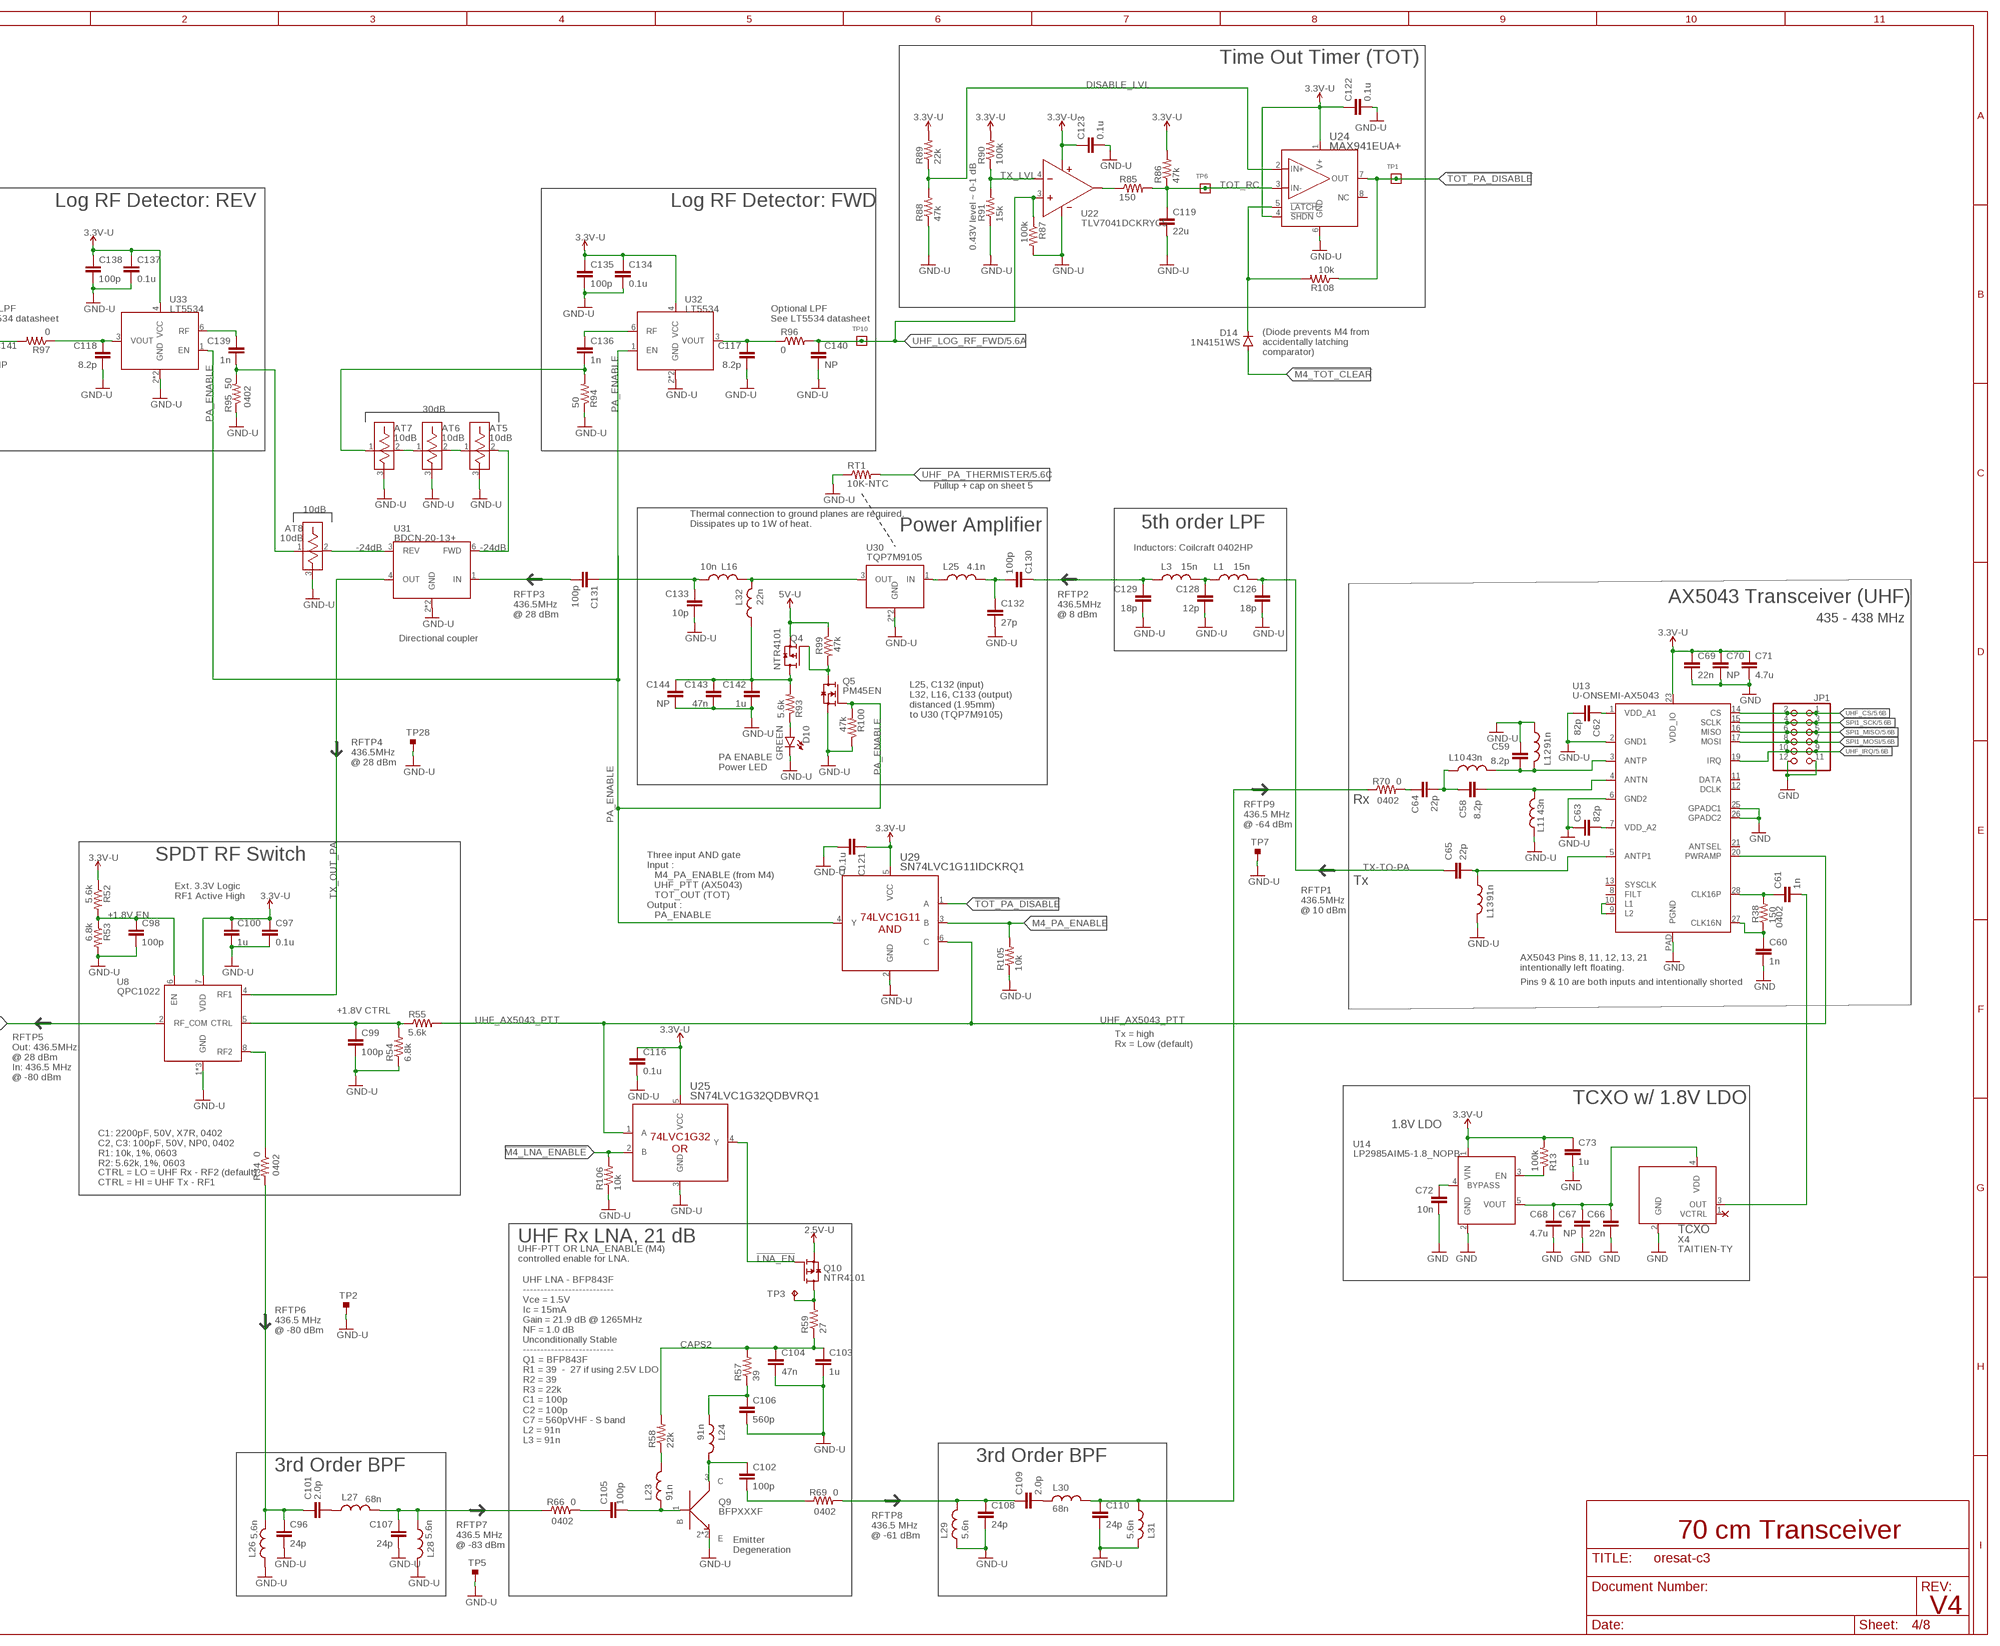
[diagram p4: schematic, sheet 4, part 2 of 2]

### Parts
AT5  10dB  PAT1220  [0805]
AT6  10dB  PAT0816  [0603]
AT7  10dB  PAT0816  [0603]
AT8  10dB  PAT0816  [0603]
C58  8.2p  C-EU0402-C-NOSILK  [.0402-C-NOSILK]
C59  8.2p  C-EU0402-C-NOSILK  [.0402-C-NOSILK]
C60  1n  C-EU0402-C-NOSILK  [.0402-C-NOSILK]
C61  1n  C-EU0402-C-NOSILK  [.0402-C-NOSILK]
C62  82p  C-EU0402-C-NOSILK  [.0402-C-NOSILK]
C63  82p  C-EU0402-C-NOSILK  [.0402-C-NOSILK]
C64  22p  C-EU0402-C-NOSILK  [.0402-C-NOSILK]
C65  22p  C-EU0402-C-NOSILK  [.0402-C-NOSILK]
C66  22n  C-EU0603-C-NOSILK  [.0603-C-NOSILK]
C67  NP  C-EU0603-C-NOSILK  [.0603-C-NOSILK]
C68  4.7u  C-EU0603-C-NOSILK  [.0603-C-NOSILK]
C69  22n  C-EU0603-C-NOSILK  [.0603-C-NOSILK]
C70  NP  C-EU0603-C-NOSILK  [.0603-C-NOSILK]
C71  4.7u  C-EU0603-C-NOSILK  [.0603-C-NOSILK]
C72  10n  C-EU0603-C-NOSILK  [.0603-C-NOSILK]
C73  1u  C-EU0603-C-NOSILK  [.0603-C-NOSILK]
C96  24p  C-EU0402-C-NOSILK  [.0402-C-NOSILK]
C97  0.1u  C-EU0603-C-NOSILK  [.0603-C-NOSILK]
C98  100p  C-EU0603-C-NOSILK  [.0603-C-NOSILK]
C99  100p  C-EU0603-C-NOSILK  [.0603-C-NOSILK]
C100  1u  C-EU0603-C-NOSILK  [.0603-C-NOSILK]
C101  2.0p  C-EU0402-C-NOSILK  [.0402-C-NOSILK]
C102  100p  C-EU0402-C-NOSILK  [.0402-C-NOSILK]
C103  1u  C-EU0603-C-NOSILK  [.0603-C-NOSILK]
C104  47n  C-EU0603-C-NOSILK  [.0603-C-NOSILK]
C105  100p  C-EU0402-C-NOSILK  [.0402-C-NOSILK]
C106  560p  C-EU0402-C-NOSILK  [.0402-C-NOSILK]
C107  24p  C-EU0402-C-NOSILK  [.0402-C-NOSILK]
C108  24p  C-EU0402-C-NOSILK  [.0402-C-NOSILK]
C109  2.0p  C-EU0402-C-NOSILK  [.0402-C-NOSILK]
C110  24p  C-EU0402-C-NOSILK  [.0402-C-NOSILK]
C116  0.1u  C-EU0603-C-NOSILK  [.0603-C-NOSILK]
C117  8.2p  C-EU0603-C-NOSILK  [.0603-C-NOSILK]
C118  8.2p  C-EU0603-C-NOSILK  [.0603-C-NOSILK]
C119  22u  C-EU0603-C-NOSILK  [.0603-C-NOSILK]
C121  0.1u  C-EU0603-C-NOSILK  [.0603-C-NOSILK]
C122  0.1u  C-EU0603-C-NOSILK  [.0603-C-NOSILK]
C123  0.1u  C-EU0603-C-NOSILK  [.0603-C-NOSILK]
C126  18p  C-EU0402-C-NOSILK  [.0402-C-NOSILK]
C128  12p  C-EU0402-C-NOSILK  [.0402-C-NOSILK]
C129  18p  C-EU0402-C-NOSILK  [.0402-C-NOSILK]
C130  100p  C-EU0402-C-NOSILK  [.0402-C-NOSILK]
C131  100p  C-EU0603-C-NOSILK  [.0603-C-NOSILK]
C132  27p  C-EU0402-C-NOSILK  [.0402-C-NOSILK]
C133  10p  C-EU0603-C-NOSILK  [.0603-C-NOSILK]
C134  0.1u  C-EU0603-C-NOSILK  [.0603-C-NOSILK]
C135  100p  C-EU0603-C-NOSILK  [.0603-C-NOSILK]
C136  1n  C-EU0402-C-NOSILK  [.0402-C-NOSILK]
C137  0.1u  C-EU0603-C-NOSILK  [.0603-C-NOSILK]
C138  100p  C-EU0603-C-NOSILK  [.0603-C-NOSILK]
C139  1n  C-EU0402-C-NOSILK  [.0402-C-NOSILK]
C140  NP  C-EU0603-C-NOSILK  [.0603-C-NOSILK]
C141  NP  C-EU0603-C-NOSILK  [.0603-C-NOSILK]
C142  1u  C-EU0603-C-NOSILK  [.0603-C-NOSILK]
C143  47n  C-EU0603-C-NOSILK  [.0603-C-NOSILK]
C144  NP  C-EU0603-C-NOSILK  [.0603-C-NOSILK]
D10  GREEN  LED-GREEN0603  [LED-0603]
D14  1N4151WS  DIODE-SOD323-R  [SOD323-R]
JP1  PINHD-2X6  [2X06]
L1  15n  L-US0402-C-NOSILK  [.0402-C-NOSILK]
L3  15n  L-US0402-C-NOSILK  [.0402-C-NOSILK]
L10  43n  L-US0402-C-NOSILK  [.0402-C-NOSILK]
L11  43n  L-US0402-C-NOSILK  [.0402-C-NOSILK]
L12  91n  L-US0603-C-NOSILK  [.0603-C-NOSILK]
L13  91n  L-US0603-C-NOSILK  [.0603-C-NOSILK]
L16  10n  L-US0603-C-NOSILK  [.0603-C-NOSILK]
L23  91n  L-US0603-C-NOSILK  [.0603-C-NOSILK]
L24  91n  L-US0603-C-NOSILK  [.0603-C-NOSILK]
L25  4.1n  L-US0402-C-NOSILK  [.0402-C-NOSILK]
L26  5.6n  L-US0402-C-NOSILK  [.0402-C-NOSILK]
L27  68n  L-US0402-C-NOSILK  [.0402-C-NOSILK]
L28  5.6n  L-US0402-C-NOSILK  [.0402-C-NOSILK]
L29  5.6n  L-US0402-C-NOSILK  [.0402-C-NOSILK]
L30  68n  L-US0402-C-NOSILK  [.0402-C-NOSILK]
L31  5.6n  L-US0402-C-NOSILK  [.0402-C-NOSILK]
L32  22n  L-US0805-C-NOSILK  [.0805-C-NOSILK]
Q4  NTR4101  P-MOSFET-SOT23-3  [SOT23-3]
Q5  PM45EN  N-MOSFET-SOT-23-3  [SOT23-3]
Q9  BFPXXXF  [TSFP4]
Q10  NTR4101  P-MOSFET-SOT23-3  [SOT23-3]
R13  100k  R-US_0603-C-NOSILK  [.0603-C-NOSILK]
R34  0  R-US_0402-C-NOSILK  [.0402-C-NOSILK]
R38  150  R-US_0402-C-NOSILK  [.0402-C-NOSILK]
R52  5.6k  R-US_0603-C-NOSILK  [.0603-C-NOSILK]
R53  6.8k  R-US_0603-C-NOSILK  [.0603-C-NOSILK]
R54  6.8k  R-US_0603-C-NOSILK  [.0603-C-NOSILK]
R55  5.6k  R-US_0603-C-NOSILK  [.0603-C-NOSILK]
R57  39  R-US_0603-C-NOSILK  [.0603-C-NOSILK]
R58  22k  R-US_0603-C-NOSILK  [.0603-C-NOSILK]
R59  27  R-US_0603-C-NOSILK  [.0603-C-NOSILK]
R66  0  R-US_0402-C-NOSILK  [.0402-C-NOSILK]
R69  0  R-US_0402-C-NOSILK  [.0402-C-NOSILK]
R70  0  R-US_0402-C-NOSILK  [.0402-C-NOSILK]
R85  150  R-US_0603-C-NOSILK  [.0603-C-NOSILK]
R86  47k  R-US_0603-C-NOSILK  [.0603-C-NOSILK]
R87  100k  R-US_0603-C-NOSILK  [.0603-C-NOSILK]
R88  47k  R-US_0603-C-NOSILK  [.0603-C-NOSILK]
R89  22k  R-US_0603-C-NOSILK  [.0603-C-NOSILK]
R90  100k  R-US_0603-C-NOSILK  [.0603-C-NOSILK]
R91  15k  R-US_0603-C-NOSILK  [.0603-C-NOSILK]
R93  5.6k  R-US_0603-C-NOSILK  [.0603-C-NOSILK]
R94  50  R-US_0402-C-NOSILK  [.0402-C-NOSILK]
R95  50  R-US_0402-C-NOSILK  [.0402-C-NOSILK]
R96  0  R-US_0603-C-NOSILK  [.0603-C-NOSILK]
R97  0  R-US_0603-C-NOSILK  [.0603-C-NOSILK]
R99  47k  R-US_0603-C-NOSILK  [.0603-C-NOSILK]
R100  47k  R-US_0603-C-NOSILK  [.0603-C-NOSILK]
R105  10k  R-US_0603-C-NOSILK  [.0603-C-NOSILK]
R106  10k  R-US_0603-C-NOSILK  [.0603-C-NOSILK]
R108  10k  R-US_0603-C-NOSILK  [.0603-C-NOSILK]
RT1  10K-NTC  R-US_0603-C-NOSILK  [.0603-C-NOSILK]
TP1  TEST-POINT-LARGE-SQUARE  [1X01]
TP2  TEST-POINT_SMD-SMD-10SN  [TESTPOINT_SMD-10SN]
TP3  TEST-POINT-LARGE  [1X01]
TP4  NO-CONNECTNO-CONNECT-DEVICE  [NO-CONNECT-FOOTPRINT]
TP5  TEST-POINT_SMD-SMD-10SN  [TESTPOINT_SMD-10SN]
TP6  TEST-POINT-LARGE-SQUARE  [1X01]
TP7  TEST-POINT_SMD-SMD-10SN  [TESTPOINT_SMD-10SN]
TP10  TEST-POINT-LARGE-SQUARE  [1X01]
TP28  TEST-POINT_SMD-SMD-10SN  [TESTPOINT_SMD-10SN]
TP29  TEST-POINT-LARGE-SQUARE  [1X01]
U8  QPC1022  [QPC1022]
U13  U-ONSEMI-AX5043  [QFN28-5X5-WITH-CENTER-PAD]
U14  LP2985AIM5-1.8_NOPB  [SOT-23]
U22  TLV7041DCKRYC5  [SC70-5]
U24  MAX941EUA+  [21-0036K_MXM]
U25  SN74LVC1G32QDBVRQ1  [DBV5]
U29  SN74LVC1G11IDCKRQ1  [DCK6]
U30  TQP7M9105  U-TQP7M9105  [U-QORVO-TQP7M9105-PA_TQP7M9105]
U31  BDCN-20-13+  [BDCN-20-13+]
U32  LT5534  [SC70]
U33  LT5534  [SC70]
X4  TAITIEN-TY  [2.5X2.0]

### Nets
1.8V-U: C66.1 C67.1 C68.1 U14.5(VOUT) X4.4(VDD)
2.5V-U: Q10.2(S) ; also sheet 2
3.3V-U: C69.1 C70.1 C71.1 C73.1 C97.1 C100.1 C116.1 C121.1 C122.1 C123.1 C134.1 C135.1 C137.1 C138.1 R13.2 R52.1 R86.2 R89.2 R90.2 U8.7(VDD) U13.23(VDD_IO) U14.1(VIN) U22.5(VCC) U24.1(V+) U24.4(!SHDN) U25.5(VCC) U29.5(VCC) U32.4(VCC) U33.4(VCC) ; also sheet 2
5V-U: Q4.2(S) R99.1 ; also sheet 2
!LATCH_FEEDBACK: D14.C R108.2 U24.5(!LATCH)
!LNA_EN: Q10.1(G) U25.4(Y)
!M4_LNA_ENABLE: R106.2 U25.2(B) ; also sheet 5
!M4_TOT_CLEAR: D14.A ; also sheet 5
!TOT_PA_DISABLE: R108.1 TP1.1 U24.7(OUT) U29.1(A) ; also sheet 5
ANTN2 [RF]: C58.2 L11.2 U13.4(ANTN)
ANTP4 [RF]: C59.2 L10.2 L12.1 U13.3(ANTP)
ANTP5 [RF]: C65.2 L13.2 U13.5(ANTP1)
B2 [RF]: C105.2 L23.1 Q9.1(B)
C2 [RF]: C102.1 L24.2 Q9.3(C)
CAPS2: C103.1 C104.1 R57.2 R58.2 R59.1
CAPS3: C142.1 C143.1 C144.1 L32.2 Q4.3(D) R93.2
CLKN2: C60.1 R38.1 U13.27(CLK16N)
CLKP2: C61.1 R38.2 U13.28(CLK16P)
CTRL1: C99.1 R54.2 R55.1 U8.5(CTRL)
DISABLE_LVL: R88.2 R89.1 U24.2(IN+)
EN1: C98.1 R52.2 R53.1 U8.6(EN)
GND: C60.2 C66.2 C67.2 C68.2 C69.2 C70.2 C71.2 C72.2 C73.2 JP1.11 JP1.12 U13.25(GPADC1) U13.26(GPADC2) U13.PAD(PGND) U14.2(GND) X4.2(GND) ; also sheet 1,2,3,5,6,7,8
GND-U: AT5.3(GND) AT6.3(GND) AT7.3(GND) AT8.3(GND) C59.1 C62.2 C63.1 C96.2 C97.2 C98.2 C99.2 C100.2 C103.2 C104.2 C106.2 C107.2 C108.2 C110.2 C116.2 C117.2 C118.2 C119.2 C121.2 C122.2 C123.2 C126.2 C128.2 C129.2 C132.2 C133.2 C134.2 C135.2 C137.2 C138.2 C140.2 C141.2 C142.2 C143.2 C144.2 D10.C L11.1 L12.2 L13.1 L26.1 L28.1 L29.1 L31.1 Q5.2(S) Q9.2(E) Q9.4(E) R53.2 R54.1 R87.2 R88.1 R91.1 R94.1 R95.1 R100.1 R105.1 R106.1 RT1.1 TP2.TP TP5.TP TP7.TP TP28.TP U8.1(GND) U8.3(GND) U8.9(GND) U13.2(GND1) U13.6(GND2) U22.2(VEE) U24.6(GND) U25.3(GND) U29.2(GND) U30.2(GND) U30.PAD(GND) U31.2(GND) U31.5(GND) U32.2(GND) U32.5(GND) U33.2(GND) U33.5(GND) ; also sheet 1,2
M4_PA_ENABLE: R105.2 U29.3(B) ; also sheet 5
N$2 [RF]: AT5.1 AT6.2
N$4: C61.2 X4.3(OUT)
N$5: C117.1 R96.1 U32.3(VOUT)
N$15: U13.9(L2) U13.10(L1)
N$16: C62.1 U13.1(VDD_A1)
N$17: C63.2 U13.7(VDD_A2)
N$19 [RF]: C58.1 C64.2 L10.1
N$20 [RF]: AT6.1 AT7.2
N$22 [RF]: C101.2 L27.1
N$23: R13.1 U14.3(EN)
N$36: L23.2 R58.1
N$41: C106.1 L24.1 R57.1
N$46: C72.1 U14.4(BYPASS)
N$47 [RF]: C109.2 L30.1
N$48: Q10.3(D) R59.2 TP3.1(TP)
N$51 [RF]: R34.1 U8.8(RF2)
N$53 [RF]: C105.1 R66.2
N$54 [RF]: C102.2 R69.1
N$55 [RF]: C64.1 R70.2
N$56: C118.1 R97.1 U33.3(VOUT)
N$73 [RF]: C128.1 L1.2 L3.1
N$74 [RF]: C129.1 C130.1 L3.2
N$75: R85.1 U22.1(OUT)
N$92 [RF]: C136.1 U32.6(RF)
N$93 [RF]: AT7.1 C136.2 R94.2
N$94 [RF]: C139.1 U33.6(RF)
N$95 [RF]: AT8.1 C139.2 R95.2
N$96 [RF]: AT5.2 U31.6(FWD)
N$103 [RF]: AT8.2 U31.3(REV)
N$104: Q4.1(G) Q5.3(D) R99.2
N$105: D10.A R93.1
PA_ENABLE: Q5.1(G) R100.2 U29.4(Y) U32.1(EN) U33.1(EN)
RX2 [RF]: C110.1 L30.2 L31.2 R70.1
SPI1_MISO: JP1.5 JP1.6 U13.16(MISO) ; also sheet 3,5
SPI1_MOSI: JP1.7 JP1.8 U13.17(MOSI) ; also sheet 3,5
SPI1_SCK: JP1.3 JP1.4 U13.15(SCLK) ; also sheet 3,5
TOT_RC: C119.1 R85.2 R86.1 TP6.1 U24.3(IN-)
TX-TO-PA [RF]: C65.1 C126.1 L1.1
TX-TO-PA$1 [RF]: C130.2 C132.1 L25.1
TX-TO-PA$2 [RF]: L25.2 U30.1(IN)
TX_LVL: R90.1 R91.2 U22.4(IN-)
TX_OUT [RF]: L16.1 L32.1 U30.3(OUT)
TX_OUT_PA [RF]: U8.4(RF1) U31.4(OUT)
TX_OUT_PA$1 [RF]: C131.2 U31.1(IN)
TX_OUT_PA$2 [RF]: C131.1 C133.1 L16.2
U-BFP-LNA-RF_IN [RF]: C107.1 L27.2 L28.2 R66.1
U-BFP-LNA-RF_OUT [RF]: C108.1 C109.1 L29.2 R69.2
UHF-BAND-ANT [RF]: U8.2(RF_COM) ; also sheet 1
UHF-RX [RF]: C96.1 C101.1 L26.2 R34.2
UHF_AX5043_PTT: R55.2 U13.20(PWRAMP) U25.1(A) U29.6(C)
UHF_CS: JP1.1 JP1.2 U13.14(CS) ; also sheet 5
UHF_IRQ: JP1.9 JP1.10 U13.19(IRQ) ; also sheet 5
UHF_LOG_RF_FWD: C140.1 R87.1 R96.2 TP10.1 U22.3(IN+) ; also sheet 5
UHF_LOG_RF_REV: C141.1 R97.2 TP29.1 ; also sheet 5
UHF_PA_THERMISTER: RT1.2 ; also sheet 5
Unconnected: U13.8(FILT) U13.11(DATA) U13.12(DCLK) U13.13(SYSCLK) U13.21(ANTSEL) U24.8(NC) X4.1(VCTRL)

### Notes on the sheet
- Time Out Timer (TOT)
- Log RF Detector: REV | Log RF Detector: FWD
- 0.43V level ~ 0-1 dB
- Optional LPF
  See LT5534 datasheet
- Optional LPF
  See LT5534 datasheet
- (Diode prevents M4 from
  accidentally latching
  comparator)
- 0402
- 30dB
- Pullup + cap on sheet 5
- 10dB
- Thermal connection to ground planes are required. 
  Dissipates up to 1W of heat.
- Power Amplifier | 5th order LPF
- -24dB | -24dB | Inductors: Coilcraft 0402HP
- AX5043 Transceiver (UHF)
- RFTP3
  436.5MHz
  @ 28 dBm
- RFTP2
  436.5MHz
  @ 8 dBm
- 435 - 438 MHz
- Directional coupler
- L25, C132 (input) 
  L32, L16, C133 (output)
  distanced (1.95mm) 
  to U30 (TQP7M9105)
- RFTP4
  436.5MHz
  @ 28 dBm
- PA ENABLE
  Power LED
- Rx | 0402
- RFTP9
  436.5 MHz
  @ -64 dBm
- SPDT RF Switch
- Tx
- Ext. 3.3V Logic
  RF1 Active High
- RFTP1
  436.5MHz
  @ 10 dBm
- +1.8V EN
- Three input AND gate
  Input :
     M4_PA_ENABLE (from M4)
     UHF_PTT (AX5043)
     TOT_OUT (TOT)
  Output :
     PA_ENABLE
- 0402
- AX5043 Pins 8, 11, 12, 13, 21
  intentionally left floating.
- Pins 9 & 10 are both inputs and intentionally shorted
- +1.8V CTRL
- Tx = high
  Rx = Low (default)
- RFTP5
  Out: 436.5MHz
  @ 28 dBm
  In: 436.5 MHz
  @ -80 dBm
- TCXO w/ 1.8V LDO
- 1.8V LDO
- C1: 2200pF, 50V, X7R, 0402
  C2, C3: 100pF, 50V, NP0, 0402
  R1: 10k, 1%, 0603
  R2: 5.62k, 1%, 0603
- 0402
- CTRL = LO = UHF Rx - RF2 (default)
  CTRL = HI = UHF Tx - RF1
- TCXO
- UHF Rx LNA, 21 dB
- UHF-PTT OR LNA_ENABLE (M4) 
  controlled enable for LNA.
- UHF LNA - BFP843F 
  --------------------------
  Vce = 1.5V
  Ic = 15mA
  Gain = 21.9 dB @ 1265MHz
  NF = 1.0 dB
  Unconditionally Stable
  --------------------------
  Q1 = BFP843F
  R1 = 39  -  27 if using 2.5V LDO
  R2 = 39
  R3 = 22k
  C1 = 100p
  C2 = 100p
  C7 = 560pVHF - S band
  L2 = 91n
  L3 = 91n
- RFTP6
  436.5 MHz
  @ -80 dBm
- 3rd Order BPF
- 3rd Order BPF
- 0402
- 0402
- RFTP8
  436.5 MHz
  @ -61 dBm
- 70 cm Transceiver
- RFTP7
  436.5 MHz
  @ -83 dBm
- Emitter
  Degeneration
- V4

## Sheet 5 of 8: Microcontroller
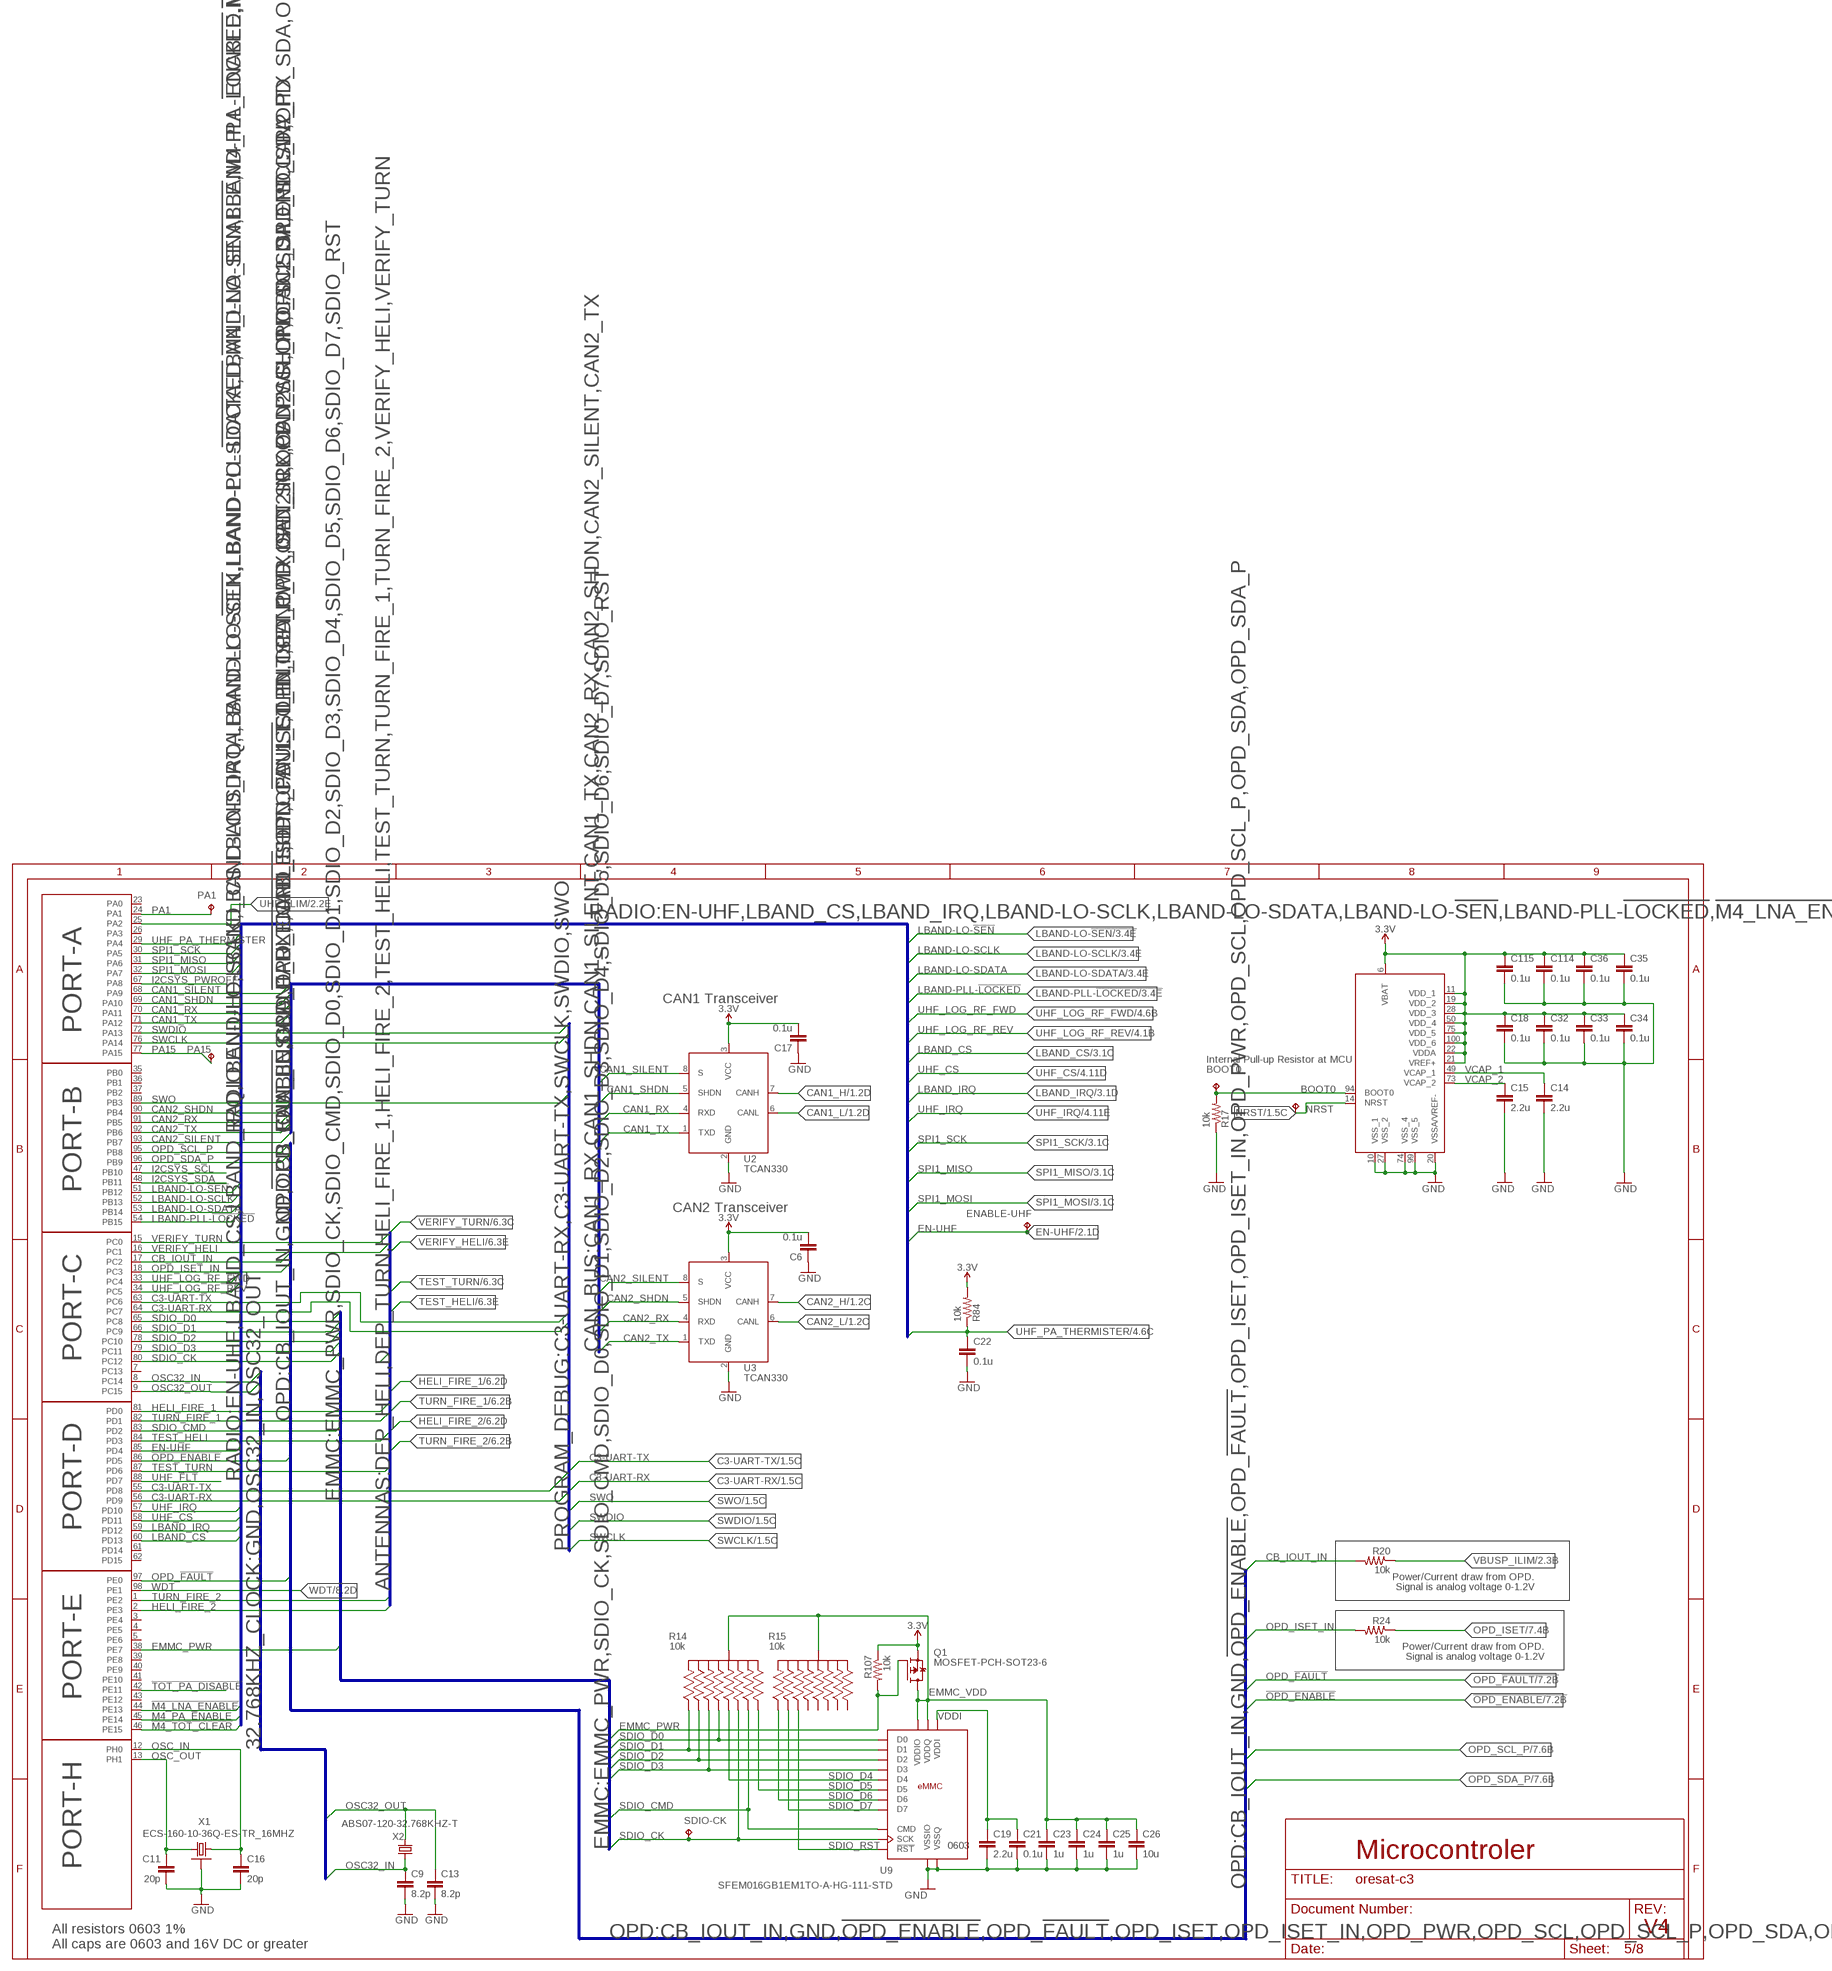
[diagram p5: schematic, sheet 5]

### Parts
BOOT0  TEST-POINT-LARGE  [1X01]
C6  0.1u  C-EU0603-C-NOSILK  [.0603-C-NOSILK]
C9  8.2p  C-EU0603-C-NOSILK  [.0603-C-NOSILK]
C11  20p  C-EU0603-C-NOSILK  [.0603-C-NOSILK]
C13  8.2p  C-EU0603-C-NOSILK  [.0603-C-NOSILK]
C14  2.2u  C-EU0603-C-NOSILK  [.0603-C-NOSILK]
C15  2.2u  C-EU0603-C-NOSILK  [.0603-C-NOSILK]
C16  20p  C-EU0603-C-NOSILK  [.0603-C-NOSILK]
C17  0.1u  C-EU0603-C-NOSILK  [.0603-C-NOSILK]
C18  0.1u  C-EU0603-C-NOSILK  [.0603-C-NOSILK]
C19  2.2u  C-EU0603-C-NOSILK  [.0603-C-NOSILK]
C21  0.1u  C-EU0603-C-NOSILK  [.0603-C-NOSILK]
C22  0.1u  C-EU0603-C-NOSILK  [.0603-C-NOSILK]
C23  1u  C-EU0603-C-NOSILK  [.0603-C-NOSILK]
C24  1u  C-EU0603-C-NOSILK  [.0603-C-NOSILK]
C25  1u  C-EU0603-C-NOSILK  [.0603-C-NOSILK]
C26  10u  C-EU0603-C-NOSILK  [.0603-C-NOSILK]
C32  0.1u  C-EU0603-C-NOSILK  [.0603-C-NOSILK]
C33  0.1u  C-EU0603-C-NOSILK  [.0603-C-NOSILK]
C34  0.1u  C-EU0603-C-NOSILK  [.0603-C-NOSILK]
C35  0.1u  C-EU0603-C-NOSILK  [.0603-C-NOSILK]
C36  0.1u  C-EU0603-C-NOSILK  [.0603-C-NOSILK]
C114  0.1u  C-EU0603-C-NOSILK  [.0603-C-NOSILK]
C115  0.1u  C-EU0603-C-NOSILK  [.0603-C-NOSILK]
ENABLE-UHF  TEST-POINT-LARGE  [1X01]
NRST  TEST-POINT-LARGE  [1X01]
PA1  TEST-POINT-LARGE  [1X01]
PA15  TEST-POINT-LARGE  [1X01]
Q1  MOSFET-PCH-SOT23-6  [SOT23-6]
R14  10k  EXB-A10P391JC_ARRAY_EXBA-M  [ARRAY_EXBA-M]
R15  10k  EXB-A10P391JC_ARRAY_EXBA-M  [ARRAY_EXBA-M]
R17  10k  R-US_0603-C-NOSILK  [.0603-C-NOSILK]
R20  10k  R-US_0603-C-NOSILK  [.0603-C-NOSILK]
R24  10k  R-US_0603-C-NOSILK  [.0603-C-NOSILK]
R84  10k  R-US_0603-C-NOSILK  [.0603-C-NOSILK]
R107  10k  R-US_0603-C-NOSILK  [.0603-C-NOSILK]
SDIO-CK  TEST-POINT-LARGE  [1X01]
U2  TCAN330  [SOT23-8_TI-DCN]
U3  TCAN330  [SOT23-8_TI-DCN]
U9  SFEM016GB1EM1TO-A-HG-111-STD  EMMC+RESET-BA  [BGA-153(11.5X13)(EMMC-BA)]
U36  STM32F439VIT6_PORT_BREAKOUT  [QFP50P1600X1600X160-100N]
X1  ECS-160-10-36Q-ES-TR_16MHZ  [2.5X2.0]
X2  ABS07-120-32.768KHZ-T  ABS07-32.768KHZ-T-SMD-2  [ABS07-32.768KHZ-T]

### Nets
3.3V: C6.2 C17.2 C18.1 C32.1 C33.1 C34.1 C35.1 C36.1 C114.1 C115.1 Q1.4(S) R84.2 R107.1 U2.3(VCC) U3.3(VCC) U36.6(VBAT) U36.11(VDD_1) U36.19(VDD_2) U36.21(VREF+) U36.22(VDDA) U36.28(VDD_3) U36.50(VDD_4) U36.75(VDD_5) U36.100(VDD_6) ; also sheet 1,2,3,7
!M4_LNA_ENABLE: U36.44(PE13) ; also sheet 4
!M4_TOT_CLEAR: U36.46(PE15) ; also sheet 4
!OPD_ENABLE: U36.86(PD5) ; also sheet 7
!TOT_PA_DISABLE: U36.42(PE11) ; also sheet 4
BOOT0: BOOT0.1(TP) R17.2 U36.94(BOOT0)
C3-UART-RX: U36.56(PD9) U36.64(PC7) ; also sheet 1
C3-UART-TX: U36.55(PD8) U36.63(PC6) ; also sheet 1
CAN1_H: U2.7(CANH) ; also sheet 1
CAN1_L: U2.6(CANL) ; also sheet 1
CAN1_RX: U2.4(RXD) U36.70(PA11)
CAN1_SHDN: U2.5(SHDN) U36.69(PA10)
CAN1_SILENT: U2.8(S) U36.68(PA9)
CAN1_TX: U2.1(TXD) U36.71(PA12)
CAN2_H: U3.7(CANH) ; also sheet 1
CAN2_L: U3.6(CANL) ; also sheet 1
CAN2_RX: U3.4(RXD) U36.91(PB5)
CAN2_SHDN: U3.5(SHDN) U36.90(PB4)
CAN2_SILENT: U3.8(S) U36.93(PB7)
CAN2_TX: U3.1(TXD) U36.92(PB6)
CB_IOUT_IN: R20.2 U36.17(PC2)
EMMC_PWR: Q1.3(G) R107.2 U36.38(PE7)
EMMC_VDD: C23.1 C24.1 C25.1 C26.1 Q1.1(D) Q1.2(D) Q1.5(D) Q1.6(D) R14.5 R14.10 R15.5 R15.10 U9.C6(VDDQ) U9.E6(VDDIO) U9.F5(VDDIO) U9.J10(VDDIO) U9.K9(VDDIO) U9.M4(VDDQ) U9.N4(VDDQ) U9.P3(VDDQ) U9.P5(VDDQ) U9.P7(VDDIO)
EN-UHF: ENABLE-UHF.1(TP) U36.85(PD4) ; also sheet 2
GND: C6.1 C9.2 C11.2 C13.2 C14.2 C15.2 C16.2 C17.1 C18.2 C19.2 C21.2 C22.2 C23.2 C24.2 C25.2 C26.2 C32.2 C33.2 C34.2 C35.2 C36.2 C114.2 C115.2 R17.1 U2.2(GND) U3.2(GND) U9.A6(VSSIO) U9.C4(VSSQ) U9.D4(VSSIO) U9.E7(VSSIO) U9.G5(VSSIO) U9.H10(VSSIO) U9.J5(VSSIO) U9.K8(VSSIO) U9.N1(VSSQ) U9.N2(VSSQ) U9.N5(VSSQ) U9.P4(VSSQ) U9.P6(VSSQ) U36.10(VSS_1) U36.20(VSSA/VREF-) U36.27(VSS_2) U36.74(VSS_4) U36.99(VSS_5) X1.2(SHIELD) X1.4(SHIELD) ; also sheet 1,2,3,4,6,7,8
HELI_FIRE_1: U36.81(PD0) ; also sheet 6
HELI_FIRE_2: U36.2(PE3) ; also sheet 6
I2CSYS_PWROFF: U36.67(PA8) ; also sheet 7
I2CSYS_SCL: U36.47(PB10) ; also sheet 7
I2CSYS_SDA: U36.48(PB11) ; also sheet 7
LBAND-LO-!SEN: U36.51(PB12) ; also sheet 3
LBAND-LO-SCLK: U36.52(PB13) ; also sheet 3
LBAND-LO-SDATA: U36.53(PB14) ; also sheet 3
LBAND-PLL-!LOCKED: U36.54(PB15) ; also sheet 3
LBAND_CS: U36.60(PD13) ; also sheet 3
LBAND_IRQ: U36.59(PD12) ; also sheet 3
M4_PA_ENABLE: U36.45(PE14) ; also sheet 4
NRST: NRST.1(TP) U36.14(NRST) ; also sheet 1
OPD_!FAULT: U36.97(PE0) ; also sheet 7
OPD_ISET: R24.1 ; also sheet 7
OPD_ISET_IN: R24.2 U36.18(PC3)
OPD_SCL_P: U36.95(PB8) ; also sheet 7
OPD_SDA_P: U36.96(PB9) ; also sheet 7
OSC32_IN: C9.1 U36.8(PC14) X2.1
OSC32_OUT: C13.1 U36.9(PC15) X2.2
OSC_IN: C16.1 U36.12(PH0) X1.1
OSC_OUT: C11.1 U36.13(PH1) X1.3
PA1: PA1.1(TP) U36.24(PA1)
PA15: PA15.1(TP) U36.77(PA15)
SDIO_CK: R14.7 SDIO-CK.1(TP) U9.M6(SCK) U36.80(PC12)
SDIO_CMD: R14.4 U9.M5(CMD) U36.83(PD2)
SDIO_D0: R14.8 U9.A3(D0) U36.65(PC8)
SDIO_D1: R14.1 U9.A4(D1) U36.66(PC9)
SDIO_D2: R14.9 U9.A5(D2) U36.78(PC10)
SDIO_D3: R14.2 U9.A1(D3) U9.B2(D3) U36.79(PC11)
SDIO_D4: R14.3 U9.A2(D4) U9.B3(D4)
SDIO_D5: R14.6 U9.B4(D5) U9.C3(D5) U9.D3(D5)
SDIO_D6: R15.1 U9.B5(D6) U9.C5(D6)
SDIO_D7: R15.9 U9.A7(D7) U9.B6(D7)
SDIO_RST: R15.2 U9.K5(!RST!)
SPI1_MISO: U36.31(PA6) ; also sheet 3,4
SPI1_MOSI: U36.32(PA7) ; also sheet 3,4
SPI1_SCK: U36.30(PA5) ; also sheet 3,4
SWCLK: U36.76(PA14) ; also sheet 1
SWDIO: U36.72(PA13) ; also sheet 1
SWO: U36.89(PB3) ; also sheet 1
TEST_HELI: U36.84(PD3) ; also sheet 6
TEST_TURN: U36.87(PD6) ; also sheet 6
TURN_FIRE_1: U36.82(PD1) ; also sheet 6
TURN_FIRE_2: U36.1(PE2) ; also sheet 6
UHF_!FLT: U36.88(PD7) ; also sheet 2
UHF_CS: U36.58(PD11) ; also sheet 4
UHF_ILIM: U36.25(PA2) ; also sheet 2
UHF_IRQ: U36.57(PD10) ; also sheet 4
UHF_LOG_RF_FWD: U36.33(PC4) ; also sheet 4
UHF_LOG_RF_REV: U36.34(PC5) ; also sheet 4
UHF_PA_THERMISTER: C22.1 R84.1 U36.29(PA4) ; also sheet 4
VBUSP_ILIM: R20.1 ; also sheet 2
VCAP_1: C14.1 U36.49(VCAP_1)
VCAP_2: C15.1 U36.73(VCAP_2)
VDDI: C19.1 C21.1 U9.C1(VDDI) U9.C2(VDDI)
VERIFY_HELI: U36.16(PC1) ; also sheet 6
VERIFY_TURN: U36.15(PC0) ; also sheet 6
WDT: U36.98(PE1) ; also sheet 8
Unconnected: R15.3 R15.4 R15.6 R15.7 R15.8 U36.3(PE4) U36.4(PE5) U36.5(PE6) U36.7(PC13) U36.23(PA0) U36.26(PA3) U36.35(PB0) U36.36(PB1) U36.37(PB2) U36.39(PE8) U36.40(PE9) U36.41(PE10) U36.43(PE12) U36.61(PD14) U36.62(PD15)

### Buses
CAN_BUS:CAN1_RX,CAN1_SHDN,CAN1_SILENT,CAN1_TX,CAN2_RX,CAN2_SHDN,CAN2_SILENT,CAN2_TX
RADIO:EN-UHF,LBAND_CS,LBAND_IRQ,LBAND-LO-SCLK,LBAND-LO-SDATA,LBAND-LO-!SEN,LBAND-PLL-!LOCKED,!M4_LNA_ENABLE,M4_PA_ENABLE,!M4_TOT_CLEAR,SPI1_MISO,SPI1_MOSI,SPI1_SCK,UHF_CS,UHF_IRQ,UHF_LOG_RF_FWD,UHF_LOG_RF_REV,UHF_PA_THERMISTER
EMMC:EMMC_PWR,SDIO_CK,SDIO_CMD,SDIO_D0,SDIO_D1,SDIO_D2,SDIO_D3,SDIO_D4,SDIO_D5,SDIO_D6,SDIO_D7,SDIO_RST
PROGRAM_DEBUG:C3-UART-RX,C3-UART-TX,SWCLK,SWDIO,SWO
OPD:CB_IOUT_IN,GND,!OPD_ENABLE,OPD_!FAULT,OPD_ISET,OPD_ISET_IN,OPD_PWR,OPD_SCL,OPD_SCL_P,OPD_SDA,OPD_SDA_P
ANTENNAS:DEP_HELI,DEP_TURN,HELI_FIRE_1,HELI_FIRE_2,TEST_HELI,TEST_TURN,TURN_FIRE_1,TURN_FIRE_2,VERIFY_HELI,VERIFY_TURN
32.768KHZ_CLOCK:GND,OSC32_IN,OSC32_OUT

### Notes on the sheet
- CAN1 Transceiver
- Internal Pull-up Resistor at MCU
- CAN2 Transceiver
- Power/Current draw from OPD.
- Signal is analog voltage 0-1.2V
- Power/Current draw from OPD.
- Signal is analog voltage 0-1.2V
- 0603
- Microcontroler
- V4
- All resistors 0603 1%
  All caps are 0603 and 16V DC or greater

## Sheet 6 of 8: Deployers
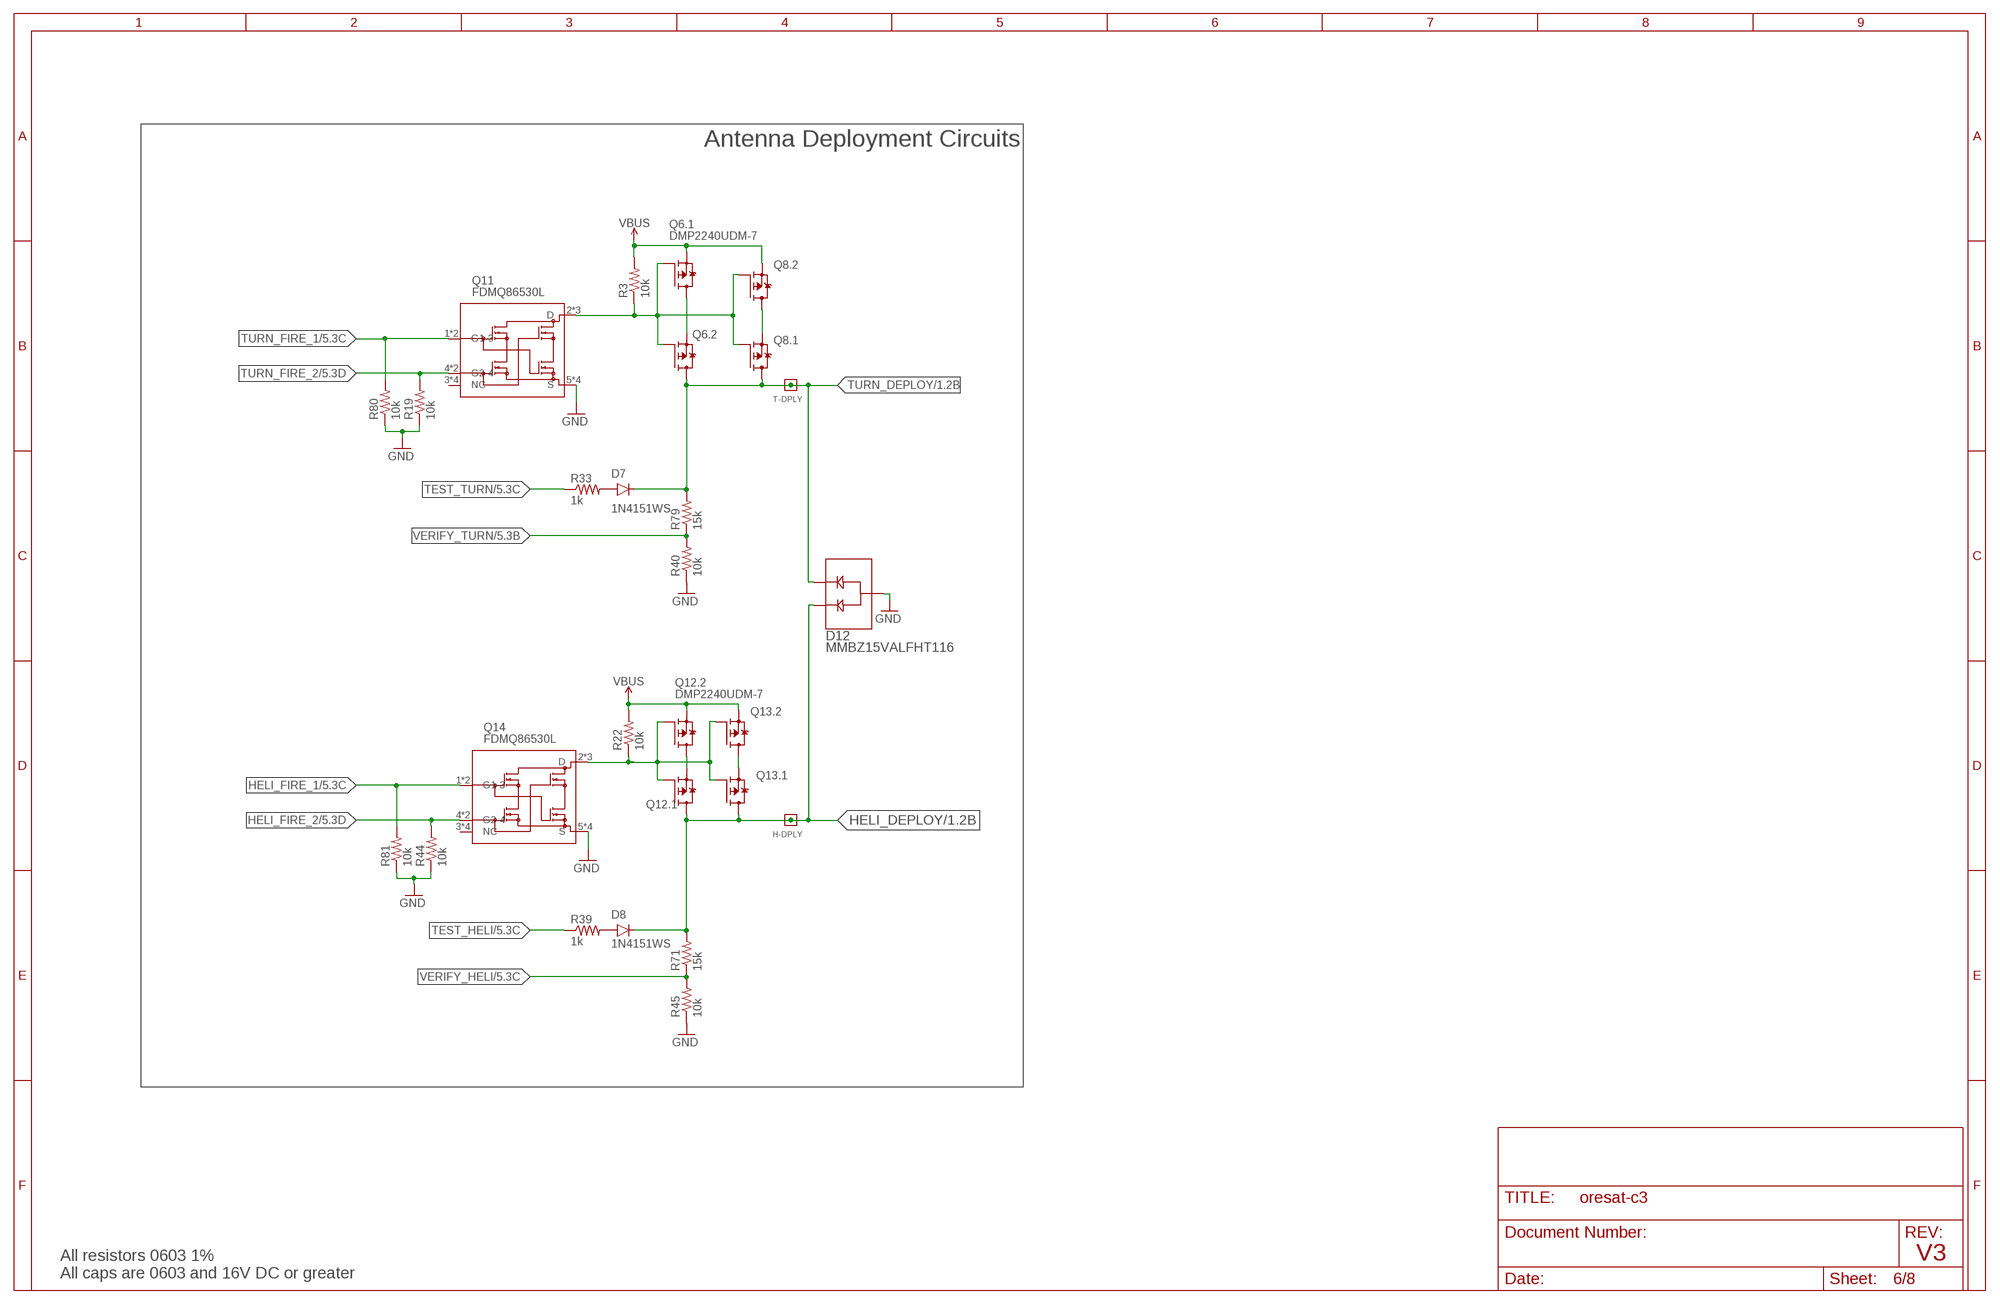
[diagram p6: schematic, sheet 6]

### Parts
D7  1N4151WS  DIODE-SOD323-R  [SOD323-R]
D8  1N4151WS  DIODE-SOD323-R  [SOD323-R]
D12  MMBZ15VALFHT116  [DIO_MMBZ1_ROM]
H-DPLY  TEST-POINT-LARGE-SQUARE  [1X01]
Q6  DMP2240UDM-7  MOSFET-PCH-SOT23-6  [SOT23-6]
Q8  DMP2240UDM-7  MOSFET-PCH-SOT23-6  [SOT23-6]
Q11  FDMQ86530L  FDMQ86530L_2-GATES  [FDMQ8203]
Q12  DMP2240UDM-7  MOSFET-PCH-SOT23-6  [SOT23-6]
Q13  DMP2240UDM-7  MOSFET-PCH-SOT23-6  [SOT23-6]
Q14  FDMQ86530L  FDMQ86530L_2-GATES  [FDMQ8203]
R3  10k  R-US_0603-C-NOSILK  [.0603-C-NOSILK]
R19  10k  R-US_0603-C-NOSILK  [.0603-C-NOSILK]
R22  10k  R-US_0603-C-NOSILK  [.0603-C-NOSILK]
R33  1k  R-US_0603-C-NOSILK  [.0603-C-NOSILK]
R39  1k  R-US_0603-C-NOSILK  [.0603-C-NOSILK]
R40  10k  R-US_0603-C-NOSILK  [.0603-C-NOSILK]
R44  10k  R-US_0603-C-NOSILK  [.0603-C-NOSILK]
R45  10k  R-US_0603-C-NOSILK  [.0603-C-NOSILK]
R71  15k  R-US_0603-C-NOSILK  [.0603-C-NOSILK]
R79  15k  R-US_0603-C-NOSILK  [.0603-C-NOSILK]
R80  10k  R-US_0603-C-NOSILK  [.0603-C-NOSILK]
R81  10k  R-US_0603-C-NOSILK  [.0603-C-NOSILK]
T-DPLY  TEST-POINT-LARGE-SQUARE  [1X01]

### Nets
GND: D12.3 Q11.5(S) Q11.6(S) Q11.7(S) Q11.8(S) Q14.5(S) Q14.6(S) Q14.7(S) Q14.8(S) R19.1 R40.1 R44.1 R45.1 R80.1 R81.1 ; also sheet 1,2,3,4,5,7,8
HELI_DEPLOY: D8.C D12.1 H-DPLY.1 Q12.6(.1:D) Q13.6(.1:D) R71.2 ; also sheet 1
HELI_FIRE_1: Q14.1(G1-3) Q14.9(G1-3) R81.2 ; also sheet 5
HELI_FIRE_2: Q14.4(G2-4) Q14.12(G2-4) R44.2 ; also sheet 5
HELI_NMOS_DRAIN: Q12.1(.1:G) Q12.3(.2:G) Q13.1(.1:G) Q13.3(.2:G) Q14.2(D) Q14.11(D) Q14.13(D) R22.1
N$1: Q6.4(.2:D) Q6.5(.1:S)
N$3: Q8.4(.2:D) Q8.5(.1:S)
N$14: D7.A R33.2
N$21: Q13.4(.2:D) Q13.5(.1:S)
N$50: D8.A R39.2
N$52: Q12.4(.2:D) Q12.5(.1:S)
TEST_HELI: R39.1 ; also sheet 5
TEST_TURN: R33.1 ; also sheet 5
TURN_DEPLOY: D7.C D12.2 Q6.6(.1:D) Q8.6(.1:D) R79.2 T-DPLY.1 ; also sheet 1
TURN_FIRE_1: Q11.1(G1-3) Q11.9(G1-3) R80.2 ; also sheet 5
TURN_FIRE_2: Q11.4(G2-4) Q11.12(G2-4) R19.2 ; also sheet 5
TURN_NMOS_DRAIN: Q6.1(.1:G) Q6.3(.2:G) Q8.1(.1:G) Q8.3(.2:G) Q11.2(D) Q11.11(D) Q11.13(D) R3.1
VBUS: Q6.2(.2:S) Q8.2(.2:S) Q12.2(.2:S) Q13.2(.2:S) R3.2 R22.2 ; also sheet 1,2,8
VERIFY_HELI: R45.2 R71.1 ; also sheet 5
VERIFY_TURN: R40.2 R79.1 ; also sheet 5
Unconnected: Q11.3(NC) Q11.10(NC) Q11.14(NC) Q11.15(NC) Q14.3(NC) Q14.10(NC) Q14.14(NC) Q14.15(NC)

### Notes on the sheet
- Antenna Deployment Circuits
- V3
- All resistors 0603 1%
  All caps are 0603 and 16V DC or greater

## Sheet 7 of 8: OPD & I2C Peripherals
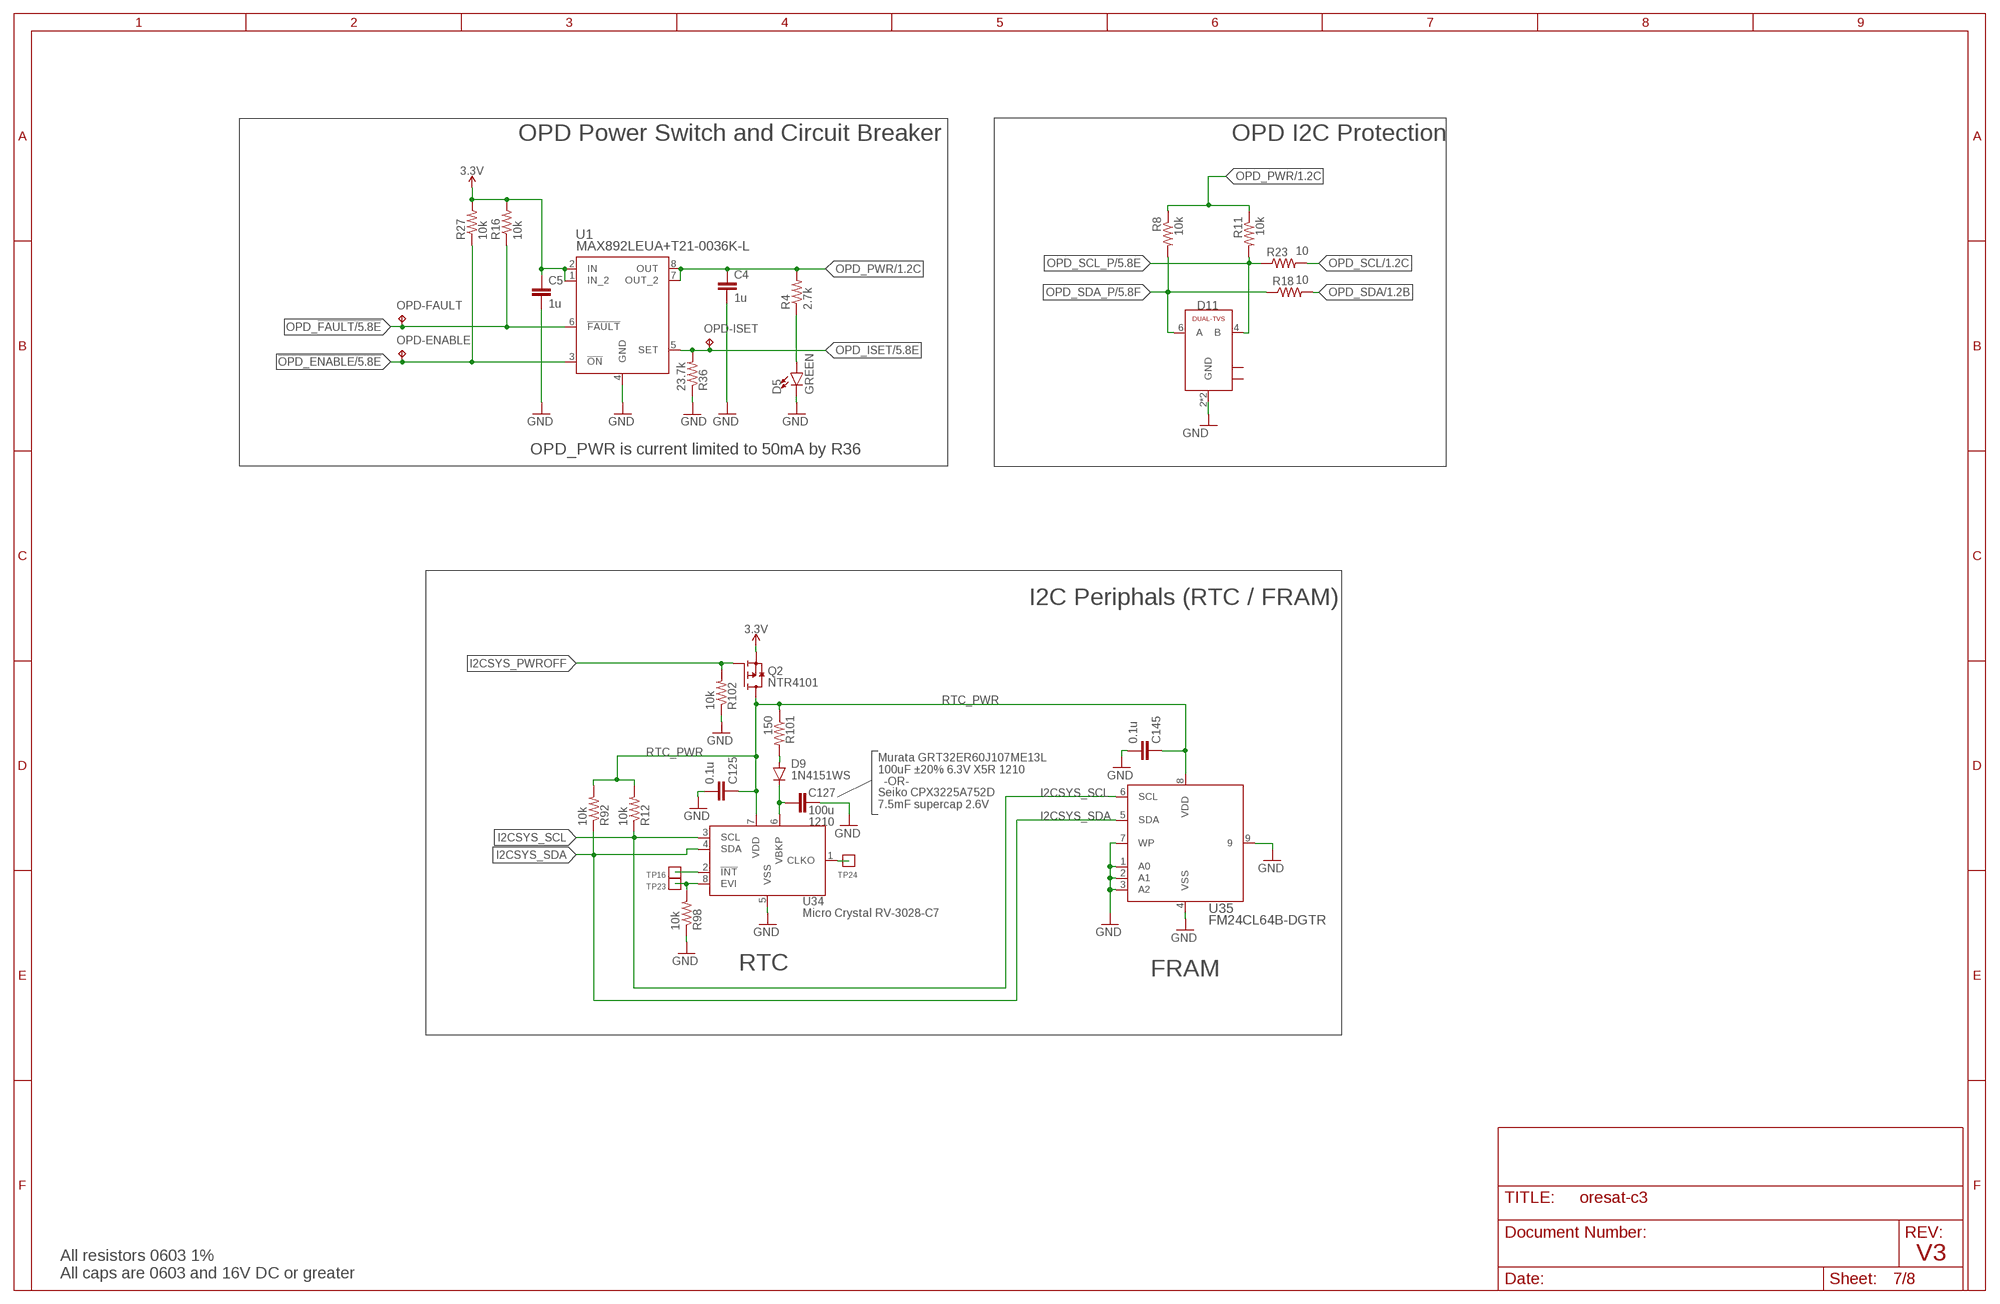
[diagram p7: schematic, sheet 7]

### Parts
C4  1u  C-EU0603-C-NOSILK  [.0603-C-NOSILK]
C5  1u  C-EU0603-C-NOSILK  [.0603-C-NOSILK]
C125  0.1u  C-EU0603-C-NOSILK  [.0603-C-NOSILK]
C127  100u  C-EUC1210K  [C1210K]
C145  0.1u  C-EU0603-C-NOSILK  [.0603-C-NOSILK]
D5  GREEN  LED-GREEN0603  [LED-0603]
D9  1N4151WS  DIODE-SOD323-R  [SOD323-R]
D11  SN65220  [SOT23-6]
OPD-ENABLE  TEST-POINT-LARGE  [1X01]
OPD-FAULT  TEST-POINT-LARGE  [1X01]
OPD-ISET  TEST-POINT-LARGE  [1X01]
Q2  NTR4101  P-MOSFET-SOT23-3  [SOT23-3]
R4  2.7k  R-US_0603-C-NOSILK  [.0603-C-NOSILK]
R8  10k  R-US_0603-C-NOSILK  [.0603-C-NOSILK]
R11  10k  R-US_0603-C-NOSILK  [.0603-C-NOSILK]
R12  10k  R-US_0603-C-NOSILK  [.0603-C-NOSILK]
R16  10k  R-US_0603-C-NOSILK  [.0603-C-NOSILK]
R18  10  R-US_0603-C-NOSILK  [.0603-C-NOSILK]
R23  10  R-US_0603-C-NOSILK  [.0603-C-NOSILK]
R27  10k  R-US_0603-C-NOSILK  [.0603-C-NOSILK]
R36  23.7k  R-US_0603-C-NOSILK  [.0603-C-NOSILK]
R92  10k  R-US_0603-C-NOSILK  [.0603-C-NOSILK]
R98  10k  R-US_0603-C-NOSILK  [.0603-C-NOSILK]
R101  150  R-US_0603-C-NOSILK  [.0603-C-NOSILK]
R102  10k  R-US_0603-C-NOSILK  [.0603-C-NOSILK]
TP16  TEST-POINT-LARGE-SQUARE  [1X01]
TP23  TEST-POINT-LARGE-SQUARE  [1X01]
TP24  TEST-POINT-LARGE-SQUARE  [1X01]
U1  MAX892LEUA+T21-0036K-L  [21-0036K-L]
U34  Micro Crystal RV-3028-C7  RV-3028-C7  [RV3028C732768KHZ1PPMTAQC]
U35  FM24CL64B-DGTR  [TDFN-8]

### Nets
3.3V: C5.1 Q2.2(S) R16.2 R27.2 U1.1(IN_2) U1.2(IN) ; also sheet 1,2,3,5
!OPD_ENABLE: OPD-ENABLE.1(TP) R27.1 U1.3(!ON) ; also sheet 5
GND: C4.2 C5.2 C125.2 C127.2 C145.2 D5.C D11.2(GND) D11.5(GND) R36.1 R98.1 R102.1 U1.4(GND) U34.5(VSS) U35.1(A0) U35.2(A1) U35.3(A2) U35.4(VSS) U35.7(WP) U35.9 ; also sheet 1,2,3,4,5,6,8
I2CSYS_PWROFF: Q2.1(G) R102.2 ; also sheet 5
I2CSYS_SCL: R12.1 U34.3(SCL) U35.6(SCL) ; also sheet 5
I2CSYS_SDA: R92.1 U34.4(SDA) U35.5(SDA) ; also sheet 5
N$58: R98.2 TP23.1 U34.8(EVI)
N$64: TP16.1 U34.2(!INT)
N$67: TP24.1 U34.1(CLKO)
N$70: D9.A R101.2
N$71: C127.1 D9.C U34.6(VBKP)
N$400: D5.A R4.1
OPD_!FAULT: OPD-FAULT.1(TP) R16.1 U1.6(!FAULT) ; also sheet 5
OPD_ISET: OPD-ISET.1(TP) R36.2 U1.5(SET) ; also sheet 5
OPD_PWR: C4.1 R4.2 R8.1 R11.1 U1.7(OUT_2) U1.8(OUT) ; also sheet 1
OPD_SCL: R23.2 ; also sheet 1
OPD_SCL_P: D11.4(B) R11.2 R23.1 ; also sheet 5
OPD_SDA: R18.2 ; also sheet 1
OPD_SDA_P: D11.6(A) R8.2 R18.1 ; also sheet 5
RTC_PWR: C125.1 C145.1 Q2.3(D) R12.2 R92.2 R101.1 U34.7(VDD) U35.8(VDD)
Unconnected: D11.1(NC1) D11.3(NC2)

### Notes on the sheet
- OPD Power Switch and Circuit Breaker | OPD I2C Protection
- OPD_PWR is current limited to 50mA by R36
- I2C Periphals (RTC / FRAM)
- Murata GRT32ER60J107ME13L
  100uF ±20% 6.3V X5R 1210
- -OR-
- Seiko CPX3225A752D
  7.5mF supercap 2.6V
- 1210
- RTC | FRAM
- V3
- All resistors 0603 1%
  All caps are 0603 and 16V DC or greater

## Sheet 8 of 8: Watchdog
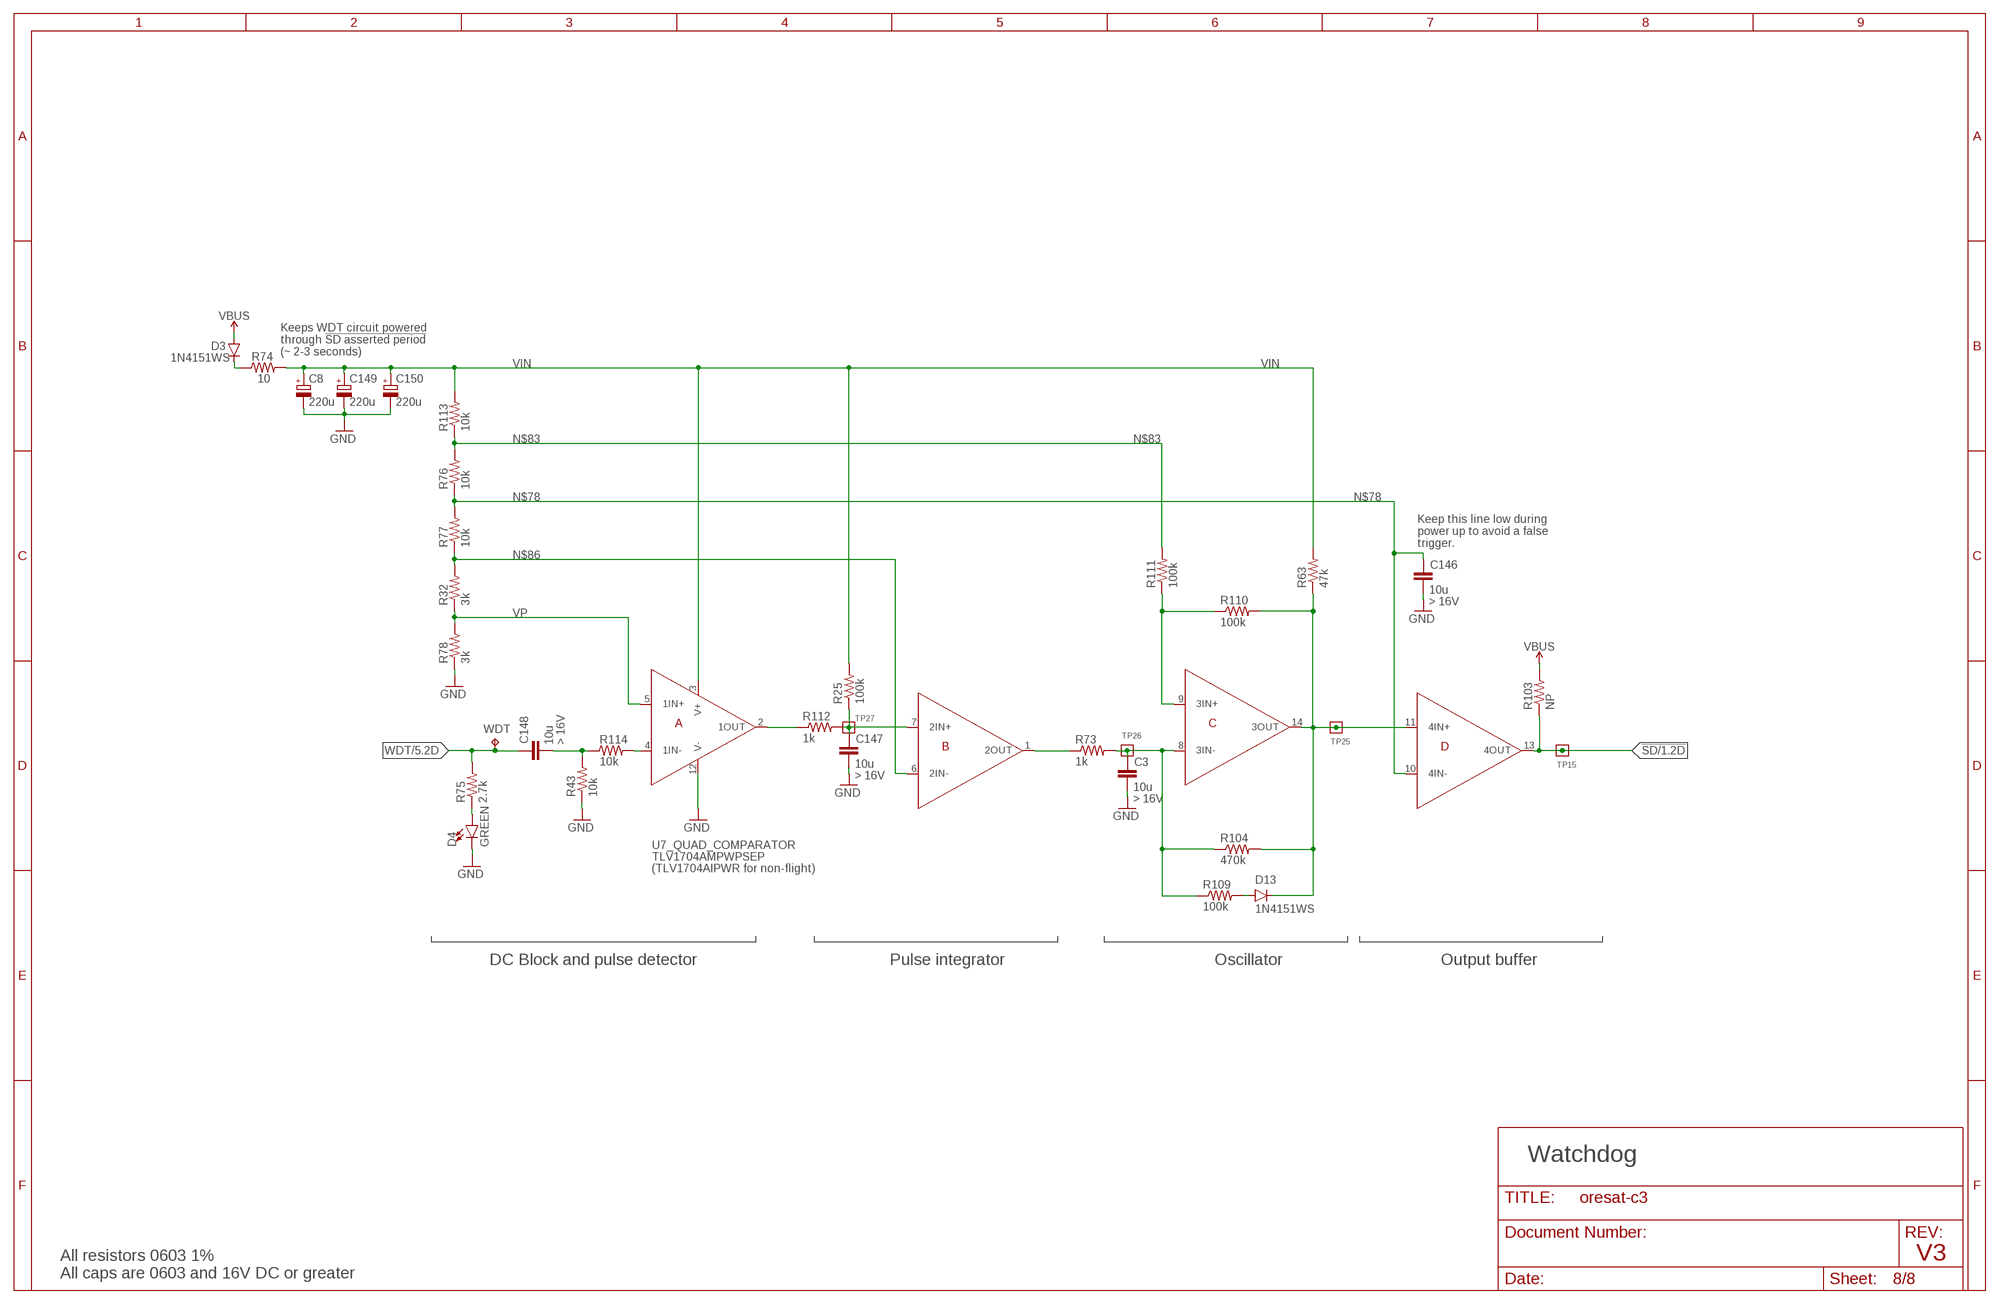
[diagram p8: schematic, sheet 8]

### Parts
C3  10u  C-EU0603-C-NOSILK  [.0603-C-NOSILK]
C8  220u  CPOL-EUD/7343-31R  [D/7343-31R]
C146  10u  C-EU0603-C-NOSILK  [.0603-C-NOSILK]
C147  10u  C-EU0603-C-NOSILK  [.0603-C-NOSILK]
C148  10u  C-EU0603-C-NOSILK  [.0603-C-NOSILK]
C149  220u  CPOL-EUD/7343-31R  [D/7343-31R]
C150  220u  CPOL-EUD/7343-31R  [D/7343-31R]
D3  1N4151WS  DIODE-SOD323-R  [SOD323-R]
D4  GREEN  LED-GREEN0603  [LED-0603]
D13  1N4151WS  DIODE-SOD323-R  [SOD323-R]
R25  100k  R-US_0603-C-NOSILK  [.0603-C-NOSILK]
R32  3k  R-US_0603-C-NOSILK  [.0603-C-NOSILK]
R43  10k  R-US_0603-C-NOSILK  [.0603-C-NOSILK]
R63  47k  R-US_0603-C-NOSILK  [.0603-C-NOSILK]
R73  1k  R-US_0603-C-NOSILK  [.0603-C-NOSILK]
R74  10  R-US_1206-C  [1206-C]
R75  2.7k  R-US_0603-C-NOSILK  [.0603-C-NOSILK]
R76  10k  R-US_0603-C-NOSILK  [.0603-C-NOSILK]
R77  10k  R-US_0603-C-NOSILK  [.0603-C-NOSILK]
R78  3k  R-US_0603-C-NOSILK  [.0603-C-NOSILK]
R103  NP  R-US_0603-C-NOSILK  [.0603-C-NOSILK]
R104  470k  R-US_0603-C-NOSILK  [.0603-C-NOSILK]
R109  100k  R-US_0603-C-NOSILK  [.0603-C-NOSILK]
R110  100k  R-US_0603-C-NOSILK  [.0603-C-NOSILK]
R111  100k  R-US_0603-C-NOSILK  [.0603-C-NOSILK]
R112  1k  R-US_0603-C-NOSILK  [.0603-C-NOSILK]
R113  10k  R-US_0603-C-NOSILK  [.0603-C-NOSILK]
R114  10k  R-US_0603-C-NOSILK  [.0603-C-NOSILK]
TP15  TEST-POINT-LARGE-SQUARE  [1X01]
TP25  TEST-POINT-LARGE-SQUARE  [1X01]
TP26  TEST-POINT-LARGE-SQUARE  [1X01]
TP27  TEST-POINT-LARGE-SQUARE  [1X01]
U7  TLV1704AMPWPSEP  TLV1704AMPWTPSEPTSSOP-14  [SOP65P640X120-14N]
WDT  TEST-POINT-LARGE  [1X01]

### Nets
!SD: R103.1 TP15.1 U7.13(-D:4OUT) ; also sheet 1
GND: C3.2 C8.- C146.2 C147.2 C149.- C150.- D4.C R43.1 R78.1 U7.12(_QUAD_COMPARATOR:V-) ; also sheet 1,2,3,4,5,6,7
N$65: R110.1 R111.1 U7.9(-C:3IN+)
N$66: D3.C R74.1
N$68: D4.A R75.1
N$72: D13.C R63.1 R104.2 R110.2 TP25.1 U7.11(-D:4IN+) U7.14(-C:3OUT)
N$76: R114.2 U7.4(_QUAD_COMPARATOR:1IN-)
N$77: D13.A R109.2
N$78: C146.1 R76.1 R77.2 U7.10(-D:4IN-)
N$79: C148.2 R43.2 R114.1
N$80: R73.1 U7.1(-B:2OUT)
N$82: C147.1 R25.1 R112.2 TP27.1 U7.7(-B:2IN+)
N$83: R76.2 R111.2 R113.1
N$85: R112.1 U7.2(_QUAD_COMPARATOR:1OUT)
N$86: R32.2 R77.1 U7.6(-B:2IN-)
VBUS: D3.A R103.2 ; also sheet 1,2,6
VIN: C8.+ C149.+ C150.+ R25.2 R63.2 R74.2 R113.2 U7.3(_QUAD_COMPARATOR:V+)
VP: R32.1 R78.2 U7.5(_QUAD_COMPARATOR:1IN+)
VT: C3.1 R73.2 R104.1 R109.1 TP26.1 U7.8(-C:3IN-)
WDT: C148.1 R75.2 WDT.1(TP) ; also sheet 5

### Notes on the sheet
- Keeps WDT circuit powered
  through !SD asserted period
  (~ 2-3 seconds)
- Keep this line low during 
  power up to avoid a false
  trigger.
- > 16V
- > 16V
- > 16V
- > 16V
- (TLV1704AIPWR for non-flight)
- DC Block and pulse detector | Pulse integrator | Oscillator | Output buffer
- Watchdog
- V3
- All resistors 0603 1%
  All caps are 0603 and 16V DC or greater